# EAGLE board jb-main (EAGLE 4.15), part 1 of 2
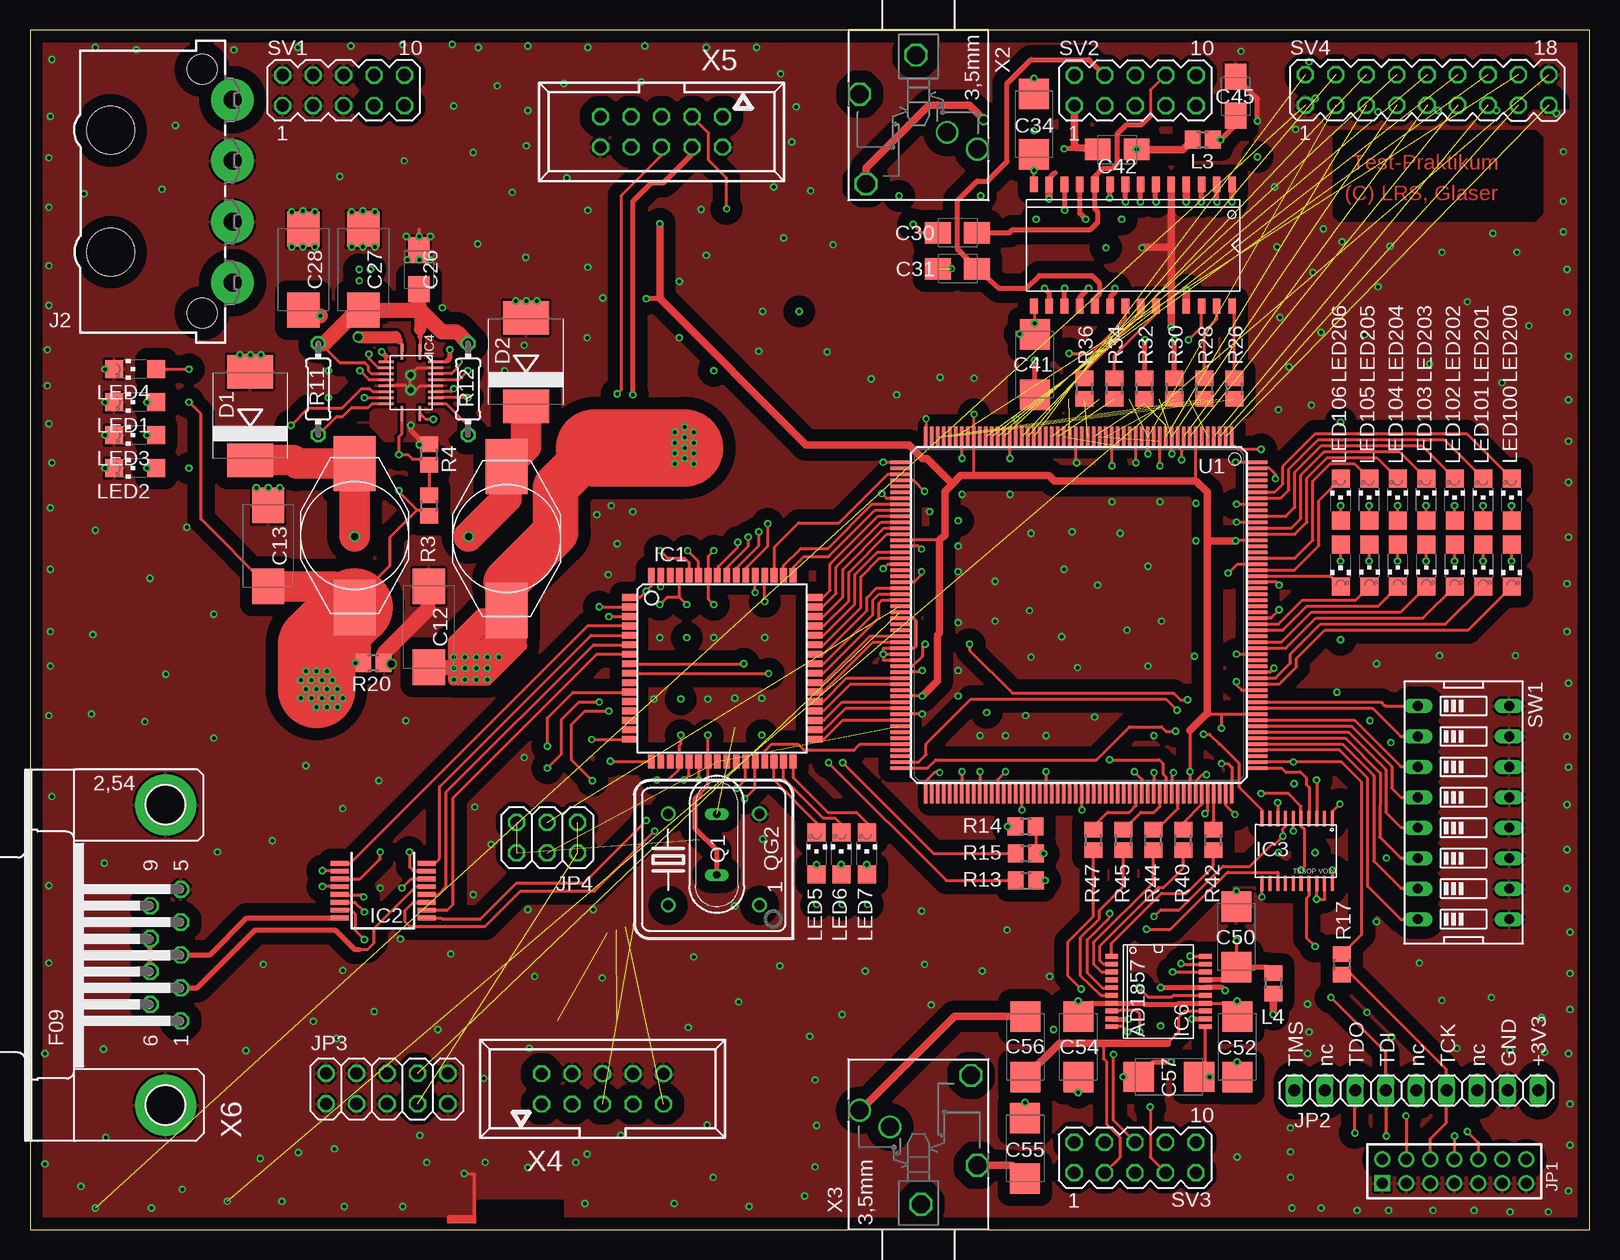
[diagram p7: board, top side]
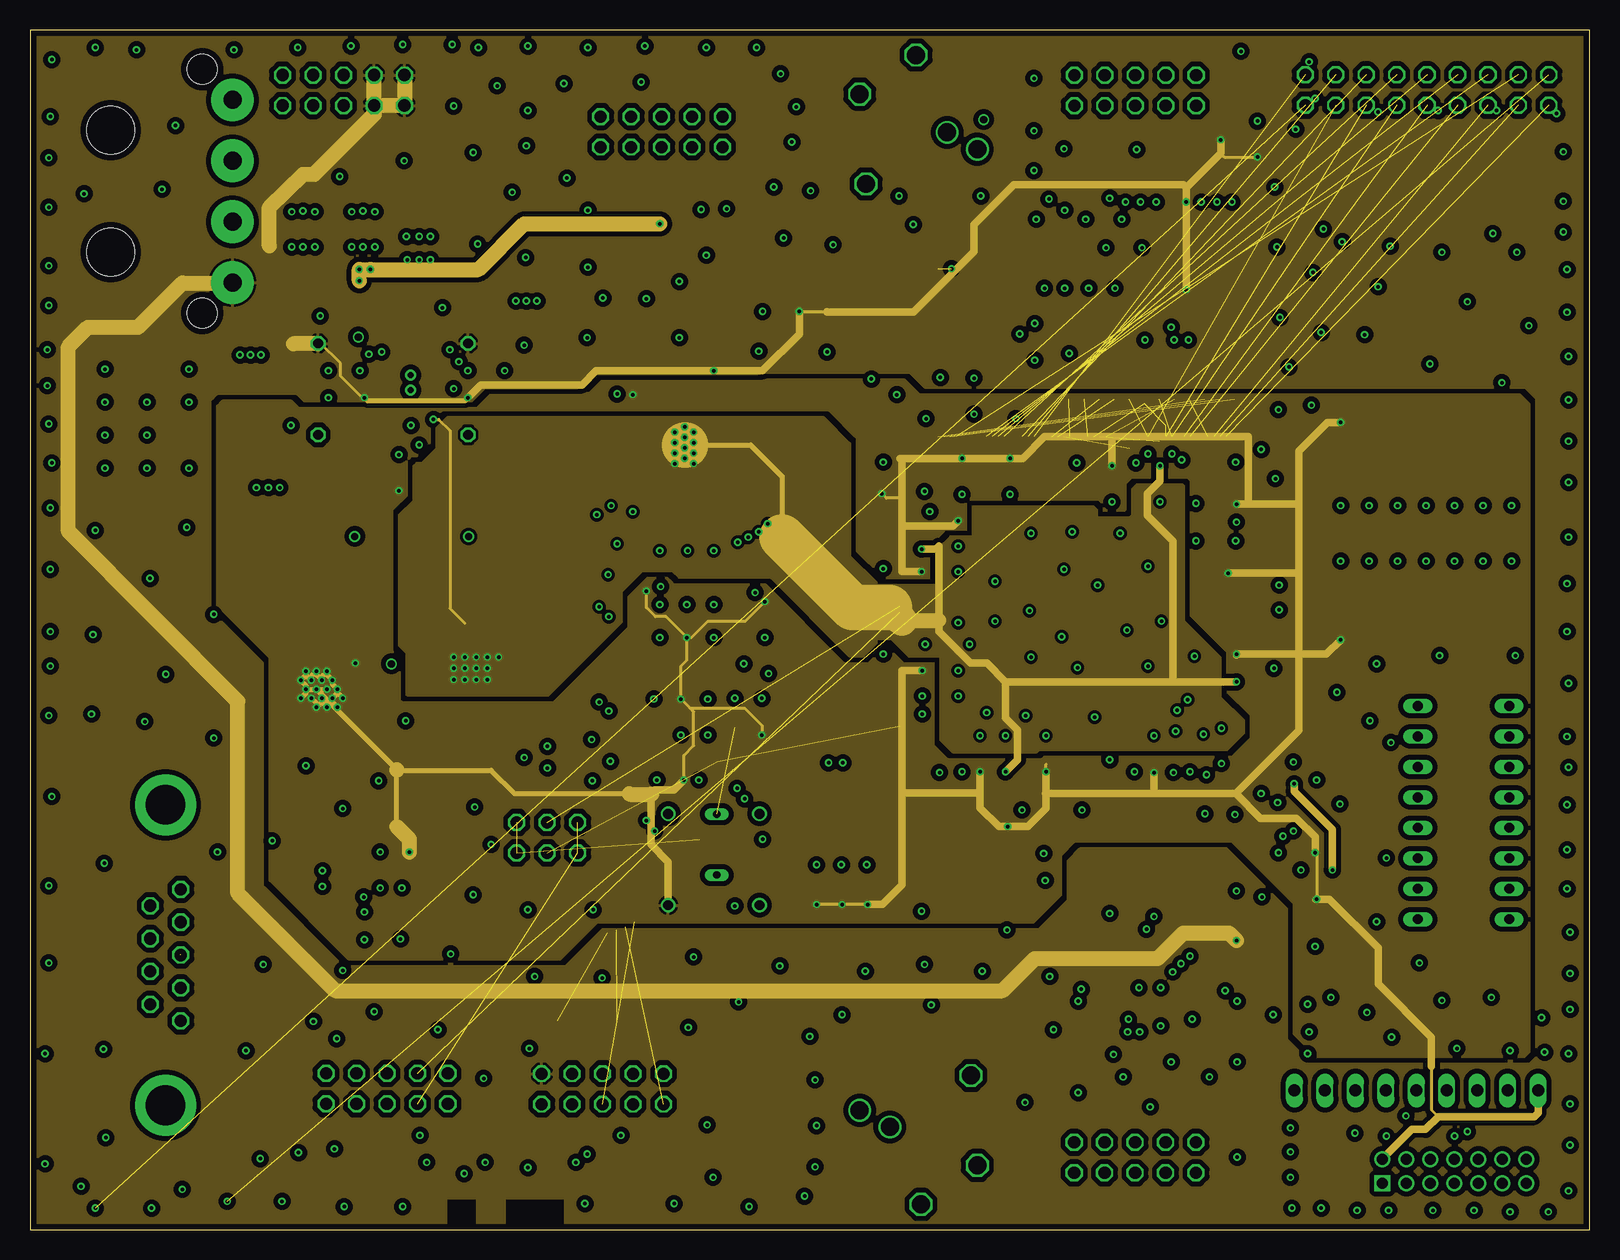
[diagram p8: board, inner layer Route2]
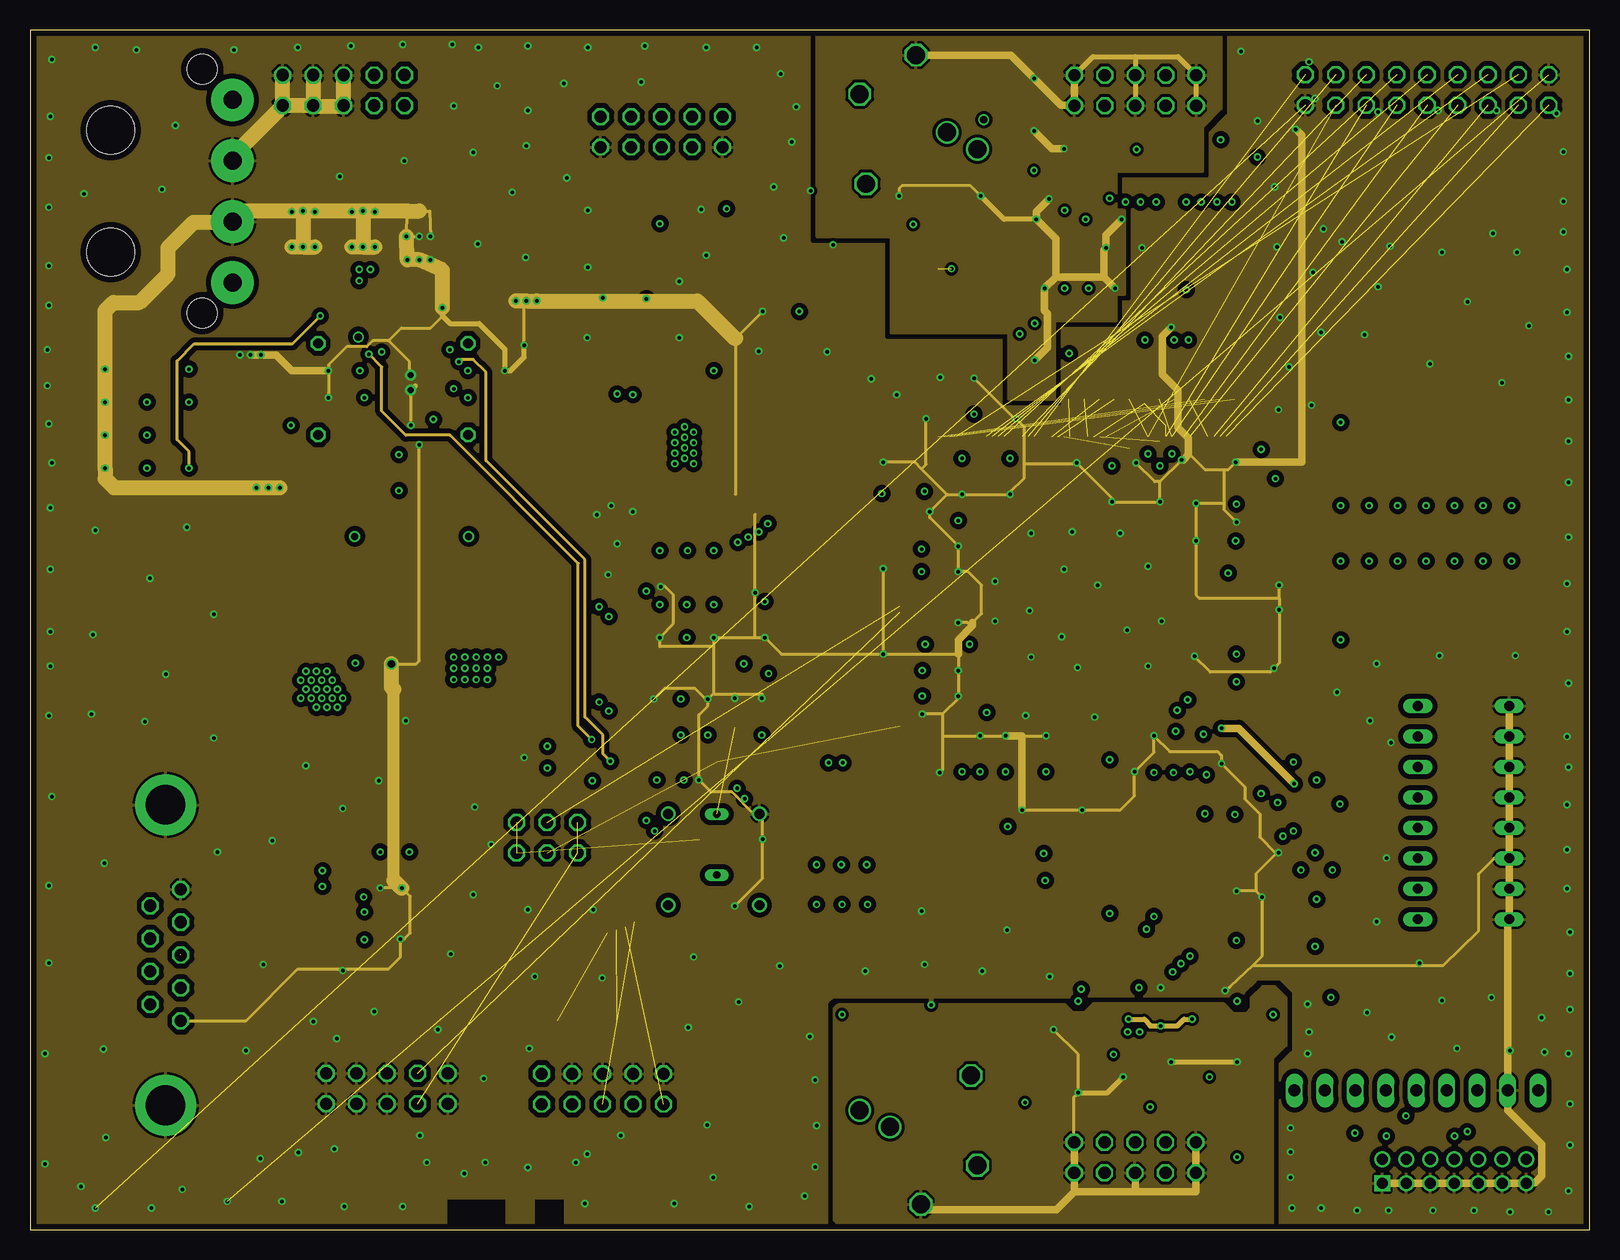
[diagram p9: board, inner layer Route15]
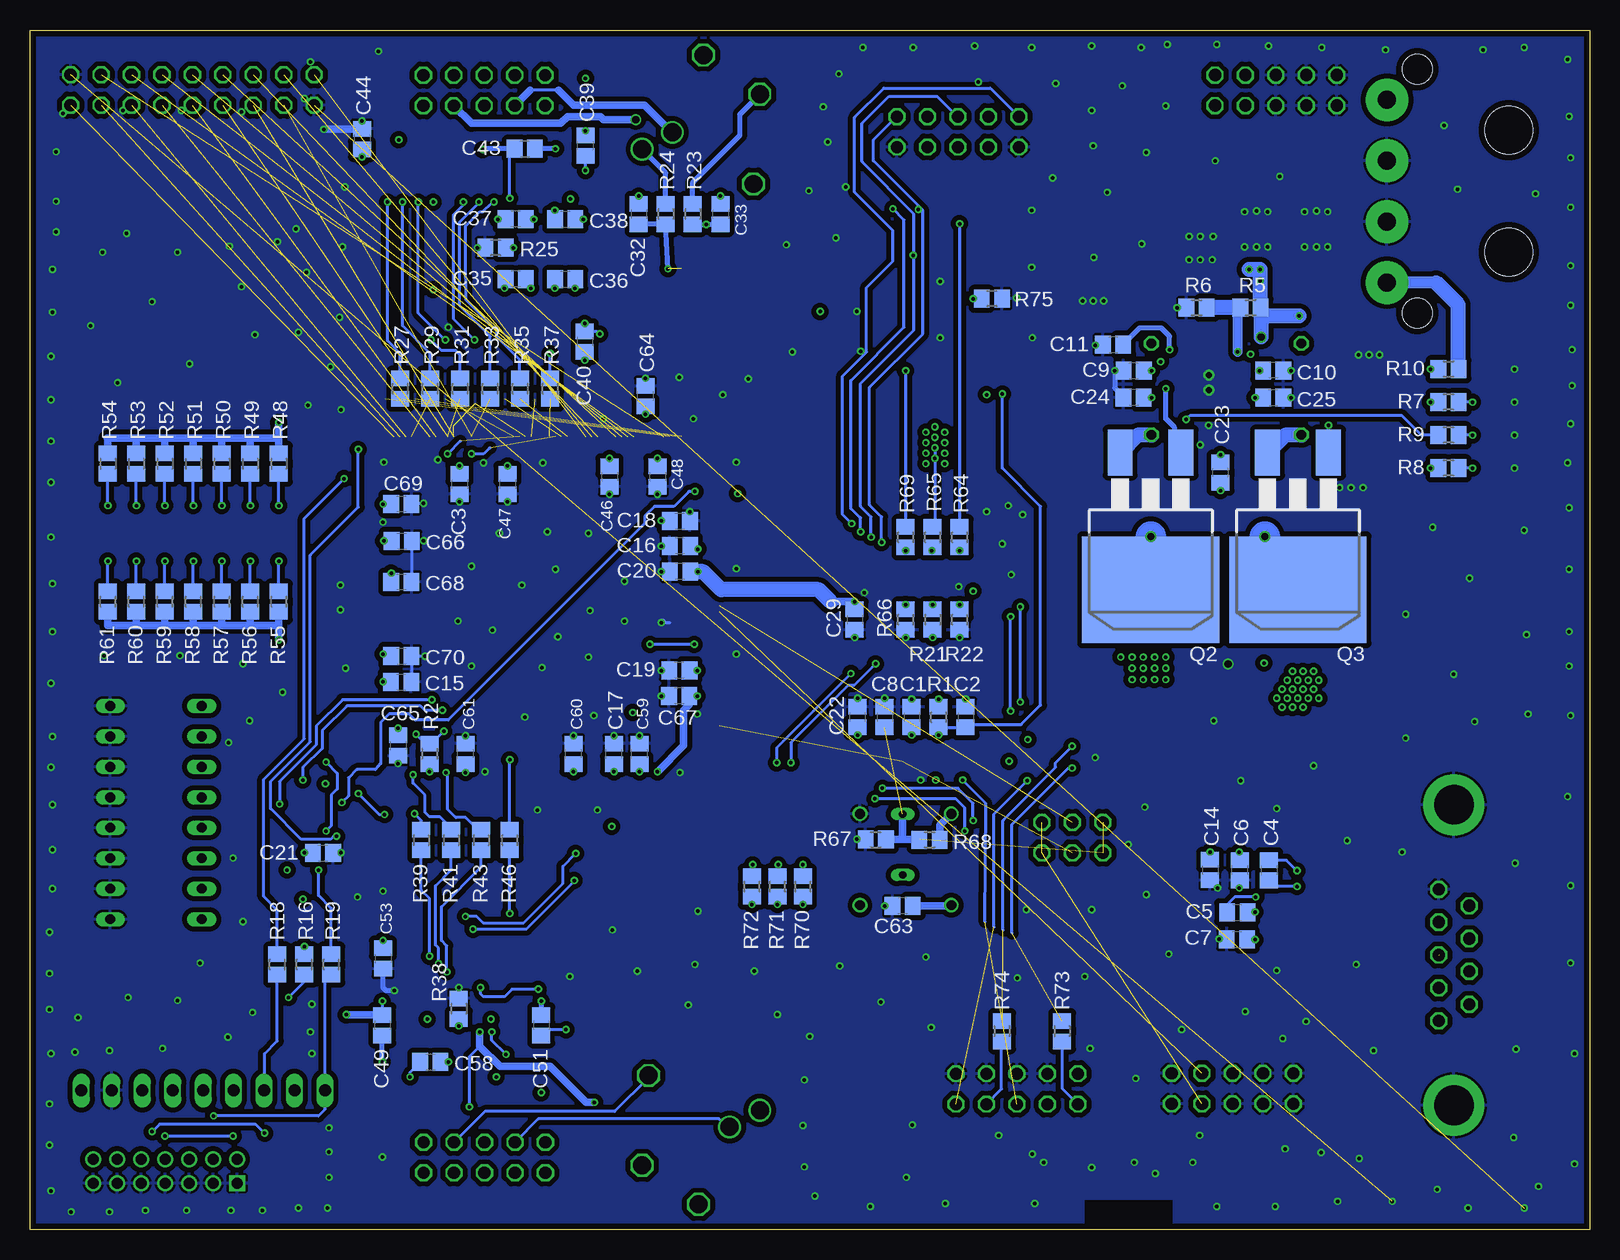
[diagram p10: board, bottom side, seen from below]

Size 130 x 100 mm. Coordinates in mm from the lower left corner, seen from the top.
Outline: 0,0 130,0 130,100 0,100 0,0
Copper layers (1*2*15*16): Top 0.035mm / dielectric 0.38mm / Route2 0.035mm / dielectric 0.71mm / Route15 0.035mm / dielectric 0.38mm / Bottom 0.035mm
Design rules "PCB-POOL-4-layer": minimum track width 0.15mm, minimum drill 0.3mm, track to track 0.15mm, track to pad 0.15mm, pad to pad 0.15mm, via to via 0.15mm, smd to smd 0mil, copper to edge 20mil, drill to drill 8mil, minimum pad ring 8mil, minimum via ring 6mil, stop-mask expansion 3mil, vias tented up to drill 0mil, thermal gap 8mil

## Footprints (pad centres in the part's own frame; a part is rotated, then mirrored left to right if it is on the bottom)
C0805 = smd 1.3 x 1.5: 1 -0.85,0; 2 0.85,0
D/7343-31W = smd 2.95 x 2.7: + 3.375,0; - -3.375,0
B/3528-21W = smd 2.15 x 1.8: + 1.625,0; - -1.625,0
C/6032-28R = smd 2.55 x 2.5: + 2.525,0; - -2.525,0
SMC = smd 2.8 x 3.8: A 3.7,0; C -3.7,0
TQFP64 = smd 1.194 x 0.559: 1 -7.76,5.905; 2 -7.76,5.118; 3 -7.76,4.331; 4 -7.76,3.543; 5 -7.76,2.756; 6 -7.76,1.968; 7 -7.76,1.181; 8 -7.76,0.394; 9 -7.76,-0.394; 10 -7.76,-1.181; 11 -7.76,-1.968; 12 -7.76,-2.756; 13 -7.76,-3.543; 14 -7.76,-4.331; 15 -7.76,-5.118; 16 -7.76,-5.905; 33 7.76,-5.905; 34 7.76,-5.118; 35 7.76,-4.331; 36 7.76,-3.543; 37 7.76,-2.756; 38 7.76,-1.968; 39 7.76,-1.181; 40 7.76,-0.394; 41 7.76,0.394; 42 7.76,1.181; 43 7.76,1.968; 44 7.76,2.756; 45 7.76,3.543; 46 7.76,4.331; 47 7.76,5.118; 48 7.76,5.905 | smd 0.559 x 1.194: 17 -5.905,-7.76; 18 -5.118,-7.76; 19 -4.331,-7.76; 20 -3.543,-7.76; 21 -2.756,-7.76; 22 -1.968,-7.76; 23 -1.181,-7.76; 24 -0.394,-7.76; 25 0.394,-7.76; 26 1.181,-7.76; 27 1.968,-7.76; 28 2.756,-7.76; 29 3.543,-7.76; 30 4.331,-7.76; 31 5.118,-7.76; 32 5.905,-7.76; 49 5.905,7.76; 50 5.118,7.76; 51 4.331,7.76; 52 3.543,7.76; 53 2.756,7.76; 54 1.968,7.76; 55 1.181,7.76; 56 0.394,7.76; 57 -0.394,7.76; 58 -1.181,7.76; 59 -1.968,7.76; 60 -2.756,7.76; 61 -3.543,7.76; 62 -4.331,7.76; 63 -5.118,7.76; 64 -5.905,7.76
SSOP16 = smd 0.4 x 1.5: 1 -2.275,-3.625; 2 -1.625,-3.625; 3 -0.975,-3.625; 4 -0.325,-3.625; 5 0.325,-3.625; 6 0.975,-3.625; 7 1.625,-3.625; 8 2.275,-3.625; 9 2.275,3.625; 10 1.625,3.625; 11 0.975,3.625; 12 0.325,3.625; 13 -0.325,3.625; 14 -0.975,3.625; 15 -1.625,3.625; 16 -2.275,3.625
VO20 = smd 0.254 x 1.27: 1 2.928,2.701; 2 2.276,2.7; 3 1.626,2.7; 4 0.977,2.701; 5 0.325,2.7; 6 -0.325,2.7; 7 -0.975,2.7; 8 -1.626,2.7; 9 -2.276,2.7; 10 -2.926,2.7; 11 -2.928,-2.7; 12 -2.28,-2.7; 13 -1.623,-2.7; 14 -0.975,-2.7; 15 -0.328,-2.7; 16 0.328,-2.7; 17 0.975,-2.71; 18 1.623,-2.7; 19 2.28,-2.7; 20 2.928,-2.7
R-PQFP-20 = smd 1.27 x 0.203: 1 -7.317,1.5; 10 -2.183,1.5; 11 -2.183,3; 20 -7.317,3 | smd 0.203 x 1.27: 2 -6.5,0.182; 3 -6,0.182; 4 -5.5,0.182; 5 -5,0.182; 6 -4.5,0.182; 7 -4,0.182; 8 -3.5,0.182; 9 -3,0.182; 12 -3,4.317; 13 -3.5,4.317; 14 -4,4.317; 15 -4.5,4.317; 16 -5,4.317; 17 -5.5,4.317; 18 -6,4.317; 19 -6.5,4.317 | drill 0.5 round: TGND1 -5.385,2.226; TGND2 -4.135,2.226
R-28 = smd 1.27 x 0.635: 1 -5.08,8.255; 2 -5.08,6.985; 3 -5.08,5.715; 4 -5.08,4.445; 5 -5.08,3.175; 6 -5.08,1.905; 7 -5.08,0.635; 8 -5.08,-0.635; 9 -5.08,-1.905; 10 -5.08,-3.175; 11 -5.08,-4.445; 12 -5.08,-5.715; 13 -5.08,-6.985; 14 -5.08,-8.255; 15 5.08,-8.255; 16 5.08,-6.985; 17 5.08,-5.715; 18 5.08,-4.445; 19 5.08,-3.175; 20 5.08,-1.905; 21 5.08,-0.635; 22 5.08,0.635; 23 5.08,1.905; 24 5.08,3.175; 25 5.08,4.445; 26 5.08,5.715; 27 5.08,6.985; 28 5.08,8.255
RS-20 = smd 1.067 x 0.406: 1 -3.901,2.926; 2 -3.901,2.276; 3 -3.901,1.626; 4 -3.901,0.975; 5 -3.901,0.325; 6 -3.901,-0.325; 7 -3.901,-0.975; 8 -3.901,-1.626; 9 -3.901,-2.276; 10 -3.901,-2.926; 11 3.901,-2.926; 12 3.901,-2.276; 13 3.901,-1.626; 14 3.901,-0.975; 15 3.901,-0.325; 16 3.901,0.325; 17 3.901,0.975; 18 3.901,1.626; 19 3.901,2.276; 20 3.901,2.926
827001 = drill 1.5 pad 3.556 round: 1 -7.62,0; 2 -2.54,0; 3 2.54,0; 4 7.62,0 | hole 4: 5.08,-10.16; -5.08,-10.16 | hole 2.5: 10.16,-2.54; -10.16,-2.54
2X07M = drill 0.914 square: 1 -6,-1 | drill 0.914 round: 2 -6,1; 3 -4,-1; 4 -4,1; 5 -2,-1; 6 -2,1; 7 0,-1; 8 0,1; 9 2,-1; 10 2,1; 11 4,-1; 12 4,1; 13 6,-1; 14 6,1
1X09 = drill 1.016 long: 1 -10.16,0; 2 -7.62,0; 3 -5.08,0; 4 -2.54,0; 5 0,0; 6 2.54,0; 7 5.08,0; 8 7.62,0; 9 10.16,0
2X05 = drill 1.016 octagon: 1 -5.08,-1.27; 2 -5.08,1.27; 3 -2.54,-1.27; 4 -2.54,1.27; 5 0,-1.27; 6 0,1.27; 7 2.54,-1.27; 8 2.54,1.27; 9 5.08,-1.27; 10 5.08,1.27
2X03 = drill 1.016 octagon: 1 -2.54,-1.27; 2 -2.54,1.27; 3 0,-1.27; 4 0,1.27; 5 2.54,-1.27; 6 2.54,1.27
L-13X10 = smd 3.5 x 4.6: 1 0,6; 2 0,-6
R0805 = smd 1.3 x 1.5: 1 -0.85,0; 2 0.85,0
CHIPLED_1206 = smd 1.5 x 1.5: A 0,-1.75; C 0,1.75
QS = drill 0.61 long: 1 -2.54,0; 2 2.54,0
D2PACK = smd 2.083 x 3.81: 1 -2.54,-8.89; 3 2.54,-8.89 | smd 11.43 x 8.89: 2 0,2.54
DIL08S = drill 0.813 round: 1 -3.81,-3.81; 4 3.81,-3.81; 5 3.81,3.81; 8 -3.81,3.81
0204/7 = drill 0.813 octagon: 1 -3.81,0; 2 3.81,0
MA05-2 = drill 1.016 octagon: 1 -5.08,-1.27; 2 -5.08,1.27; 3 -2.54,-1.27; 4 -2.54,1.27; 5 0,-1.27; 6 0,1.27; 7 2.54,-1.27; 8 2.54,1.27; 9 5.08,-1.27; 10 5.08,1.27
MA09-2 = drill 1.016 octagon: 1 -10.16,-1.27; 2 -10.16,1.27; 3 -7.62,-1.27; 4 -7.62,1.27; 5 -5.08,-1.27; 6 -5.08,1.27; 7 -2.54,-1.27; 8 -2.54,1.27; 9 0,-1.27; 10 0,1.27; 11 2.54,-1.27; 12 2.54,1.27; 13 5.08,-1.27; 14 5.08,1.27; 15 7.62,-1.27; 16 7.62,1.27; 17 10.16,-1.27; 18 10.16,1.27
EDG-08 = drill 0.813 long: 1 -8.89,-3.81; 2 -6.35,-3.81; 3 -3.81,-3.81; 4 -1.27,-3.81; 5 1.27,-3.81; 6 3.81,-3.81; 7 6.35,-3.81; 8 8.89,-3.81; 9 8.89,3.81; 10 6.35,3.81; 11 3.81,3.81; 12 1.27,3.81; 13 -1.27,3.81; 14 -3.81,3.81; 15 -6.35,3.81; 16 -8.89,3.81
PQ208 = smd 1.6 x 0.3: P1 -14.9,12.75; P2 -14.9,12.25; P3 -14.9,11.75; P4 -14.9,11.25; P5 -14.9,10.75; P6 -14.9,10.25; P7 -14.9,9.75; P8 -14.9,9.25; P9 -14.9,8.75; P10 -14.9,8.25; P11 -14.9,7.75; P12 -14.9,7.25; P13 -14.9,6.75; P14 -14.9,6.25; P15 -14.9,5.75; P16 -14.9,5.25; P17 -14.9,4.75; P18 -14.9,4.25; P19 -14.9,3.75; P20 -14.9,3.25; P21 -14.9,2.75; P22 -14.9,2.25; P23 -14.9,1.75; P24 -14.9,1.25; P25 -14.9,0.75; P26 -14.9,0.25; P27 -14.9,-0.25; P28 -14.9,-0.75; P29 -14.9,-1.25; P30 -14.9,-1.75; P31 -14.9,-2.25; P32 -14.9,-2.75; P33 -14.9,-3.25; P34 -14.9,-3.75; P35 -14.9,-4.25; P36 -14.9,-4.75; P37 -14.9,-5.25; P38 -14.9,-5.75; P39 -14.9,-6.25; P40 -14.9,-6.75; P41 -14.9,-7.25; P42 -14.9,-7.75; P43 -14.9,-8.25; P44 -14.9,-8.75; P45 -14.9,-9.25; P46 -14.9,-9.75; P47 -14.9,-10.25; P48 -14.9,-10.75; P49 -14.9,-11.25; P50 -14.9,-11.75; P51 -14.9,-12.25; P52 -14.9,-12.75; P105 14.9,-12.75; P106 14.9,-12.25; P107 14.9,-11.75; P108 14.9,-11.25; P109 14.9,-10.75; P110 14.9,-10.25; P111 14.9,-9.75; P112 14.9,-9.25; P113 14.9,-8.75; P114 14.9,-8.25; P115 14.9,-7.75; P116 14.9,-7.25; P117 14.9,-6.75; P118 14.9,-6.25; P119 14.9,-5.75; P120 14.9,-5.25; P121 14.9,-4.75; P122 14.9,-4.25; P123 14.9,-3.75; P124 14.9,-3.25; P125 14.9,-2.75; P126 14.9,-2.25; P127 14.9,-1.75; P128 14.9,-1.25; P129 14.9,-0.75; P130 14.9,-0.25; P131 14.9,0.25; P132 14.9,0.75; P133 14.9,1.25; P134 14.9,1.75; P135 14.9,2.25; P136 14.9,2.75; P137 14.9,3.25; P138 14.9,3.75; P139 14.9,4.25; P140 14.9,4.75; P141 14.9,5.25; P142 14.9,5.75; P143 14.9,6.25; P144 14.9,6.75; P145 14.9,7.25; P146 14.9,7.75; P147 14.9,8.25; P148 14.9,8.75; P149 14.9,9.25; P150 14.9,9.75; P151 14.9,10.25; P152 14.9,10.75; P153 14.9,11.25; P154 14.9,11.75; P155 14.9,12.25; P156 14.9,12.75 | smd 0.3 x 1.6: P53 -12.75,-14.9; P54 -12.25,-14.9; P55 -11.75,-14.9; P56 -11.25,-14.9; P57 -10.75,-14.9; P58 -10.25,-14.9; P59 -9.75,-14.9; P60 -9.25,-14.9; P61 -8.75,-14.9; P62 -8.25,-14.9; P63 -7.75,-14.9; P64 -7.25,-14.9; P65 -6.75,-14.9; P66 -6.25,-14.9; P67 -5.75,-14.9; P68 -5.25,-14.9; P69 -4.75,-14.9; P70 -4.25,-14.9; P71 -3.75,-14.9; P72 -3.25,-14.9; P73 -2.75,-14.9; P74 -2.25,-14.9; P75 -1.75,-14.9; P76 -1.25,-14.9; P77 -0.75,-14.9; P78 -0.25,-14.9; P79 0.25,-14.9; P80 0.75,-14.9; P81 1.25,-14.9; P82 1.75,-14.9; P83 2.25,-14.9; P84 2.75,-14.9; P85 3.25,-14.9; P86 3.75,-14.9; P87 4.25,-14.9; P88 4.75,-14.9; P89 5.25,-14.9; P90 5.75,-14.9; P91 6.25,-14.9; P92 6.75,-14.9; P93 7.25,-14.9; P94 7.75,-14.9; P95 8.25,-14.9; P96 8.75,-14.9; P97 9.25,-14.9; P98 9.75,-14.9; P99 10.25,-14.9; P100 10.75,-14.9; P101 11.25,-14.9; P102 11.75,-14.9; P103 12.25,-14.9; P104 12.75,-14.9; P157 12.75,14.9; P158 12.25,14.9; P159 11.75,14.9; P160 11.25,14.9; P161 10.75,14.9; P162 10.25,14.9; P163 9.75,14.9; P164 9.25,14.9; P165 8.75,14.9; P166 8.25,14.9; P167 7.75,14.9; P168 7.25,14.9; P169 6.75,14.9; P170 6.25,14.9; P171 5.75,14.9; P172 5.25,14.9; P173 4.75,14.9; P174 4.25,14.9; P175 3.75,14.9; P176 3.25,14.9; P177 2.75,14.9; P178 2.25,14.9; P179 1.75,14.9; P180 1.25,14.9; P181 0.75,14.9; P182 0.25,14.9; P183 -0.25,14.9; P184 -0.75,14.9; P185 -1.25,14.9; P186 -1.75,14.9; P187 -2.25,14.9; P188 -2.75,14.9; P189 -3.25,14.9; P190 -3.75,14.9; P191 -4.25,14.9; P192 -4.75,14.9; P193 -5.25,14.9; P194 -5.75,14.9; P195 -6.25,14.9; P196 -6.75,14.9; P197 -7.25,14.9; P198 -7.75,14.9; P199 -8.25,14.9; P200 -8.75,14.9; P201 -9.25,14.9; P202 -9.75,14.9; P203 -10.25,14.9; P204 -10.75,14.9; P205 -11.25,14.9; P206 -11.75,14.9; P207 -12.25,14.9; P208 -12.75,14.9
PG203J = drill 1.499 octagon: 1 -5.004,-0.203; 4 5.74,-4.369; 5 -1.753,-4.902 | drill 1.499 round: 2 2.845,4.902; 3 1.448,2.388
057-010-1 = drill 1 octagon: 1 -5.08,-1.27; 2 -5.08,1.27; 3 -2.54,-1.27; 4 -2.54,1.27; 5 0,-1.27; 6 0,1.27; 7 2.54,-1.27; 8 2.54,1.27; 9 5.08,-1.27; 10 5.08,1.27
F09HP = drill 1.016 octagon: 1 -5.486,-1.27; 2 -2.743,-1.27; 3 0,-1.27; 4 2.743,-1.27; 5 5.486,-1.27; 6 -4.115,1.27; 7 -1.372,1.27; 8 1.372,1.27; 9 4.115,1.27 | drill 3.302 pad 5.08 round: G1 -12.522,0; G2 12.522,0

## Placement (x,y rotation side)
C1  15p  [C0805]  56.5,42.72 270 bottom
C2  100n  [C0805]  52,42.72 270 bottom
C3  100n  [C0805]  94.19,62.16 270 bottom
C4  100n  [C0805]  26.72,29.95 270 bottom
C5  100n  [C0805]  29.36,26.44 0 bottom
C6  100n  [C0805]  29.16,29.95 90 bottom
C7  100n  [C0805]  29.4,24.18 0 bottom
C8  15p  [C0805]  58.75,42.72 270 bottom
C9  1n5  [C0805]  38,71.6 0 bottom
C10  1n5  [C0805]  26.37,71.62 180 bottom
C11  10n  [C0805]  39.71,73.76 0 bottom
C12  100u  [D/7343-31W]  33.25,50.23 270 top
C13  100u  [D/7343-31W]  19.86,56.98 270 top
C14  100n  [C0805]  31.63,29.97 270 bottom
C15  100n  [C0805]  99.07,45.66 0 bottom
C16  100n  [C0805]  75.82,56.97 180 bottom
C17  100n  [C0805]  81.32,39.66 90 bottom
C18  100n  [C0805]  75.83,59.07 0 bottom
C19  100n  [C0805]  75.87,46.62 180 bottom
C20  100n  [C0805]  75.81,54.86 180 bottom
C21  100n  [C0805]  105.58,31.4 0 bottom
C22  100n  [C0805]  61,42.72 90 bottom
C23  10p  [C0805]  30.75,63.09 90 bottom
C24  100n  [C0805]  38,69.34 180 bottom
C25  100n  [C0805]  26.37,69.37 0 bottom
C26  1u  [B/3528-21W]  32.42,80.03 270 top
C27  100u  [D/7343-31W]  27.79,80.03 270 top
C28  10u  [D/7343-31W]  22.8,80.03 270 top
C29  100n  [C0805]  61.25,50.84 270 bottom
C30  1u  [B/3528-21W]  77.32,83.09 0 top
C31  1u  [B/3528-21W]  77.32,80.09 0 top
C32  2n2  [C0805]  79.25,84.66 270 bottom
C33  2n2  [C0805]  72.44,84.66 270 bottom
C34  4u7  [C/6032-28R]  83.69,92.16 270 top
C35  470p  [C0805]  89.5,79.22 180 bottom
C36  470p  [C0805]  85.38,79.22 0 bottom
C37  470p  [C0805]  89.5,84.22 180 bottom
C38  470p  [C0805]  85.38,84.22 0 bottom
C39  100n  [C0805]  83.69,90.34 90 bottom
C40  100n  [C0805]  83.75,74.03 270 bottom
C41  4u7  [C/6032-28R]  83.75,72.09 90 top
C42  1u  [B/3528-21W]  90.63,90.03 0 top
C43  100n  [C0805]  88.75,90.09 0 bottom
C44  10n  [C0805]  102.32,90.91 270 bottom
C45  1u  [B/3528-21W]  100.5,94.47 270 top
C46  100n  [C0805]  81.69,62.78 270 bottom
C47  100n  [C0805]  90.19,62.16 270 bottom
C48  100n  [C0805]  77.69,62.78 270 bottom
C49  100n  [C0805]  100.63,17.03 270 bottom
C50  4u7  [C/6032-28R]  100.57,24.41 270 top
C51  100n  [C0805]  87.38,17.03 270 bottom
C52  4u7  [C/6032-28R]  100.63,15.22 90 top
C53  10n  [C0805]  100.57,22.59 270 bottom
C54  4u7  [C/6032-28R]  87.38,15.22 90 top
C55  4u7  [C/6032-28R]  82.95,6.76 90 top
C56  4u7  [C/6032-28R]  82.98,15.24 270 top
C57  4u7  [C/6032-28R]  94.94,12.72 0 top
C58  100n  [C0805]  96.63,13.97 0 bottom
C59  100n  [C0805]  79.19,39.66 90 bottom
C60  100n  [C0805]  84.69,39.66 90 bottom
C61  100n  [C0805]  93.69,39.66 90 bottom
C63  100n  [C0805]  57.25,26.97 180 bottom
C64  100n  [C0805]  78.69,69.47 90 bottom
C65  100n  [C0805]  99.32,40.34 270 bottom
C66  100n  [C0805]  99,57.41 0 bottom
C67  100n  [C0805]  75.88,44.47 180 bottom
C68  100n  [C0805]  99.04,53.99 0 bottom
C69  100n  [C0805]  99.04,60.5 0 bottom
C70  100n  [C0805]  99.04,47.82 0 bottom
D1  MBRS340T3  [SMC]  18.36,67.81 90 top
D2  MBRS340T3  [SMC]  41.35,72.31 90 top
IC1  MEGA64-A  [TQFP64]  57.69,46.77 0 top
IC2  MAX3221CAE  [SSOP16]  29.42,28.25 270 top
IC3  XCF04S-VO20  [VO20]  105.63,31.54 0 top
IC4  TPS75003  [R-PQFP-20]  29.5,65.84 270 top
IC5  AD1870SOL-28  [R-28]  91.94,82.05 270 top
IC6  AD1857  [RS-20]  94.07,19.84 0 top
J2  [827001]  16.89,86.56 270 top
JP1  [2X07M]  118.73,4.86 0 top
JP2  JTAG FPGA  [1X09]  115.56,11.6 0 top
JP3  [2X05]  29.75,11.75 0 top
JP4  [2X03]  43.11,32.66 180 top
L1  15u  [L-13X10]  39.71,57.59 0 top
L2  L-13X10  [L-13X10]  27.05,57.84 0 top
L3  1u  [R0805]  97.75,90.84 0 top
L4  1u  [R0805]  103.63,20.53 270 top
LED1  +3V3  [CHIPLED_1206]  8.75,68.97 90 top
LED2  +2V5  [CHIPLED_1206]  8.75,63.47 90 top
LED3  +1V8  [CHIPLED_1206]  8.75,66.22 90 top
LED4  +5V0  [CHIPLED_1206]  8.75,71.72 90 top
LED5  GRÜN  [CHIPLED_1206]  65.57,31.34 0 top
LED6  GELB  [CHIPLED_1206]  67.63,31.34 0 top
LED7  ROT  [CHIPLED_1206]  69.75,31.34 0 top
LED100  ROT  [CHIPLED_1206]  123.5,55.34 180 top
LED101  GELB  [CHIPLED_1206]  121.13,55.37 180 top
LED102  GELB  [CHIPLED_1206]  118.76,55.37 180 top
LED103  GRÜN  [CHIPLED_1206]  116.39,55.37 180 top
LED104  GRÜN  [CHIPLED_1206]  114.03,55.37 180 top
LED105  GRÜN  [CHIPLED_1206]  111.66,55.37 180 top
LED106  GRÜN  [CHIPLED_1206]  109.25,55.34 180 top
LED200  ROT  [CHIPLED_1206]  123.5,60.84 0 top
LED201  GELB  [CHIPLED_1206]  121.13,60.84 0 top
LED202  GELB  [CHIPLED_1206]  118.75,60.84 0 top
LED203  GRÜN  [CHIPLED_1206]  116.38,60.84 0 top
LED204  GRÜN  [CHIPLED_1206]  114,60.84 0 top
LED205  GRÜN  [CHIPLED_1206]  111.63,60.84 0 top
LED206  GRÜN  [CHIPLED_1206]  109.25,60.84 0 top
Q1  <=8MHz  [QS]  57.25,32.09 270 top
Q2  IRFR5305  [D2PACK]  36.58,55.88 180 bottom
Q3  IRFR5305  [D2PACK]  24.3,55.88 180 bottom
QG2  <=8MHz  [DIL08S]  57,30.84 90 top
R1  10k  [R0805]  54.25,42.72 90 bottom
R2  330  [R0805]  96.69,39.66 270 bottom
R3  56k  [R0805]  33.25,60.34 270 top
R4  33k  [R0805]  33.25,64.59 270 top
R5  39k  [R0805]  28.25,76.84 0 bottom
R6  10k  [R0805]  32.75,76.84 0 bottom
R7  150  [R0805]  11.75,68.97 180 bottom
R8  100  [R0805]  11.75,63.47 180 bottom
R9  10  [R0805]  11.75,66.22 180 bottom
R10  220  [R0805]  11.75,71.72 0 bottom
R11  33m  [0204/7]  24.03,70.06 90 top
R12  33m  [0204/7]  36.52,70.06 90 top
R13  100  [R0805]  83.02,29.09 0 top
R14  100  [R0805]  83.02,31.34 0 top
R15  4k7  [R0805]  82.99,33.59 180 top
R16  30  [R0805]  107.13,22.09 90 bottom
R17  30  [R0805]  109.37,22.11 90 top
R18  30  [R0805]  109.38,22.09 90 bottom
R19  30  [R0805]  104.88,22.09 90 bottom
R20  47  [R0805]  28.63,47.22 180 top
R21  1k  [R0805]  54.75,50.84 270 bottom
R22  3k3  [R0805]  52.5,50.84 90 bottom
R23  330  [R0805]  74.75,84.66 270 bottom
R24  330  [R0805]  77,84.66 270 bottom
R25  0  [R0805]  91.19,81.84 180 bottom
R26  4k7  [R0805]  100.38,70.09 270 top
R27  4k7  [R0805]  99.13,70.09 90 bottom
R28  4k7  [R0805]  97.88,70.09 270 top
R29  4k7  [R0805]  96.63,70.09 90 bottom
R30  4k7  [R0805]  95.38,70.09 270 top
R31  4k7  [R0805]  94.13,70.09 90 bottom
R32  4k7  [R0805]  92.88,70.09 270 top
R33  4k7  [R0805]  91.63,70.09 90 bottom
R34  4k7  [R0805]  90.38,70.09 270 top
R35  4k7  [R0805]  89.13,70.09 90 bottom
R36  4k7  [R0805]  87.88,70.09 270 top
R37  4k7  [R0805]  86.63,70.09 90 bottom
R38  0  [R0805]  94.25,18.41 270 bottom
R39  4k7  [R0805]  97.38,32.47 270 bottom
R40  4k7  [R0805]  96.13,32.47 90 top
R41  4k7  [R0805]  94.88,32.47 270 bottom
R42  4k7  [R0805]  98.63,32.47 90 top
R43  4k7  [R0805]  92.38,32.47 270 bottom
R44  4k7  [R0805]  93.63,32.47 90 top
R45  4k7  [R0805]  91.13,32.47 270 top
R46  4k7  [R0805]  90,32.47 90 bottom
R47  4k7  [R0805]  88.63,32.47 270 top
R48  100  [R0805]  109.25,63.84 270 bottom
R49  100  [R0805]  111.63,63.84 270 bottom
R50  100  [R0805]  114,63.84 270 bottom
R51  100  [R0805]  116.38,63.84 270 bottom
R52  100  [R0805]  118.75,63.84 270 bottom
R53  100  [R0805]  121.13,63.84 270 bottom
R54  150  [R0805]  123.5,63.84 270 bottom
R55  100  [R0805]  109.25,52.34 90 bottom
R56  100  [R0805]  111.63,52.34 90 bottom
R57  100  [R0805]  114,52.34 90 bottom
R58  100  [R0805]  116.38,52.34 90 bottom
R59  100  [R0805]  118.75,52.34 90 bottom
R60  100  [R0805]  121.13,52.34 90 bottom
R61  150  [R0805]  123.5,52.34 90 bottom
R64  4k7  [R0805]  52.5,57.72 90 bottom
R65  4k7  [R0805]  54.75,57.72 90 bottom
R66  4k7  [R0805]  57,50.84 90 bottom
R67  1k  [R0805]  59.5,32.51 0 bottom
R68  560  [R0805]  55.01,32.5 0 bottom
R69  4k7  [R0805]  57,57.72 90 bottom
R70  100  [R0805]  65.57,28.59 90 bottom
R71  100  [R0805]  67.69,28.59 90 bottom
R72  150  [R0805]  69.82,28.59 90 bottom
R73  1k  [R0805]  43.97,16.53 270 bottom
R74  1k  [R0805]  48.97,16.53 270 bottom
R75  22  [R0805]  49.82,77.59 180 bottom
SV1  [MA05-2]  26.14,94.97 0 top
SV2  [MA05-2]  92.13,94.96 0 top
SV3  [MA05-2]  92.12,6 0 top
SV4  [MA09-2]  116.46,95 0 top
SW1  [EDG-08]  119.5,34.76 270 top
U1  XC3S500EPQ208  [PQ208]  87.43,51.22 270 top
X2  PG203J  [PG203J]  74.07,92.91 270 top
X3  PG203J  [PG203J]  74.07,7.09 90 top
X4  SPI uC  [057-010-1]  47.73,11.73 0 top
X5  JTAG uC  [057-010-1]  52.65,91.52 180 top
X6  [F09HP]  11.3,22.88 90 top

## Tracks (layer width: path | path; a pad name or v marks a point on that pad's centre or on a via)
+3V3  (via drill 0.3)
  Top 0.254: R3.2 32.78,59.97 32.25,59.97 | 32.25,59.97 30.75,61.47 v30.75,61.59 | IC1.52 61.24,52.36 v61.25,52.34 | IC1.64 51.79,53.63 v51.38,53.22 50.84,52.68 IC1.1 | R20.2 v27.13,47.22 | IC2.15 31.97,29.88 31.63,30.22 v31.63,31.47 | IC1.21 54.94,37.91 v54.5,37.47 | C13.+ 14.25,59.21 14.25,67.97 v13.25,68.97 | 32.25,59.97 30,57.72 30,55.34 27.57,52.91 27.57,52.34 27.07,51.84 | U1.P88 74.25,46.47 v74.38,46.59 | U1.P73 73.69,53.97 74.32,54.59 v74.32,54.84 | U1.P46 77.69,66.11 v77.69,64.28 | U1.P38 81.69,66.11 v81.69,64.28 | v100.57,60.47 U1.P201 | v99.88,54.72 100.63,55.47 U1.P191 | v100.57,47.97 U1.P176 | IC3.18 v107.25,27.53 107.94,27.53 107.94,28.81 IC3.19 | U1.P114 79.18,38.14 v79.19,38.16 | R15.2 v81.51,33.59 v81.5,33.59 | U1.P125 84.68,38.14 v84.69,38.16 | U1.P143 93.68,36.33 93.69,36.34 v93.69,38.09 | v71,61.34 71.38,60.97 U1.P59 | U1.P21 90.19,66.11 v90.19,63.66
  Top 0.406: X5.4 55.19,89.66 52.82,87.28 51.82,87.28 50.25,85.72 v50.25,69.59
  Top 1.27: R20.2 27.78,51.13 27.07,51.84
  Top 2.54: L2.2 27.07,51.84 27,51.91 25.3,53.61 C13.+
  Top 6.452: 27,51.91 23.88,48.78 v23.88,46.53 v23.88,45.03
  Route2 0.254: v54.75,49.34 55.13,49.34 56.5,50.72 59.63,50.72 v61.25,52.34 | v51.38,53.22 51.38,51.84 52.13,51.09 53,51.09 v54.75,49.34 | QG2.8 | 55,43.47 59.57,43.47 61,42.03 v61,41.22 | 55,43.47 55.32,43.16 55.32,40.34 54.5,39.53 v54.5,37.47 | 55,43.47 v54.25,44.22 54.25,46.97 54.75,47.47 v54.75,49.34 | v107.13,31.41 107.25,31.41 v107.25,27.53 | 117.38,9.41 116.82,9.97 116.82,13.6 | 84.69,38.78 v84.69,38.16 84.63,38.09 84.63,36.34 | 72.69,60.97 71.38,60.97 v71,61.34 | v69.82,27.09 v67.69,27.09 v65.57,27.09
  Route2 0.406: v23.88,45.03 30.6,38.31 30.63,38.28 38.44,38.28 40.38,36.34 49.94,36.34 | 30.57,33.59 30.57,38.28 | 23,46.22 v22.57,45.78 23,45.34 v23,45.03 | 23,46.22 v23,46.53 | 23,46.22 v23.44,45.78 23.44,46.09 v23.88,46.53 23.88,46.22 v24.32,45.78 24.32,46.09 v24.75,46.53 24.75,46.22 v25.19,45.78 25.19,45.47 v25.63,45.03 25.63,44.72 | 25.63,44.72 v26.07,44.28 | 25.63,44.72 v25.19,44.28 | v25.19,44.28 25.19,43.97 v25.63,43.53 | v25.19,44.28 24.75,43.84 v24.75,43.53 24.32,43.97 | 24.32,43.97 v23.88,43.53 23.88,43.84 v23.44,44.28 | 24.32,43.97 v24.32,44.28 | v23,45.03 23,44.72 v22.57,44.28 | v23,45.03 v24.75,45.03
  Route2 0.61: v54.5,37.47 53.69,36.66 52.07,36.66 51.75,36.34 51.75,36.28 51.75,32.09 53.19,30.66 QG2.8 | JP2.9 125.72,9.75 125.38,9.41 117.38,9.41 116.32,8.35 115.19,8.35 112.7,5.86 | 112.7,5.86 112.69,5.84 | 112.7,5.86 JP1.2 | v109.25,49.16 108.07,47.97 105.75,47.97 | v100.57,47.97 100.57,47.91 100.63,47.97 105.75,47.97 | v109.25,67.28 108.13,67.28 105.75,64.91 105.75,60.47 | 101.57,60.47 105.75,60.47 | 101.57,60.47 v100.57,60.47 | 105.75,60.47 105.75,54.72 | 105.75,54.72 105.75,47.97 | 105.75,54.72 v99.88,54.72 | 116.82,13.6 116.82,16.03 112.38,20.47 112.38,23.47 108.32,27.53 v107.25,27.53 107.19,27.53 | 79.19,36.41 79.19,35.16 80.75,33.59 v81.5,33.59 83.19,33.59 84.69,35.09 v84.69,38.16 | 79.19,36.41 v79.19,38.16 | 93.69,36.34 v93.69,38.09 | 93.69,36.34 84.63,36.34 | v74.38,46.59 72.69,46.59 72.69,36.41 | v74.32,54.84 72.69,54.84 72.69,58.66 | 79.19,36.41 72.69,36.41 | 72.69,58.66 72.69,60.97 72.69,64.09 72.5,64.28 v77.69,64.28 v81.69,64.28 82.75,64.28 84.57,66.09 90.19,66.09 | v77.38,59.09 76.94,58.66 72.69,58.66 | 90.19,66.09 v90.19,63.66 | 90.19,66.09 101.57,66.09 101.57,60.47 | 100.5,36.34 93.69,36.34 | 100.5,36.34 105.75,41.59 105.75,47.97 | 100.5,36.34 102.57,34.28 105.57,34.28 107.13,32.72 v107.13,31.41 | 72.69,36.41 72.69,28.72 71.07,27.09 v69.82,27.09
  Route2 1.27: v31.63,31.47 31.63,32.53 30.57,33.59 | 51.82,36.28 51.75,36.28 50,36.28 49.94,36.34 | 30.57,38.28 | 30.57,38.28 30.6,38.31
  Bottom 0.254: v30.75,61.59 C23.1 | v54.75,49.34 R21.2 | v61.25,52.34 C29.1 | C14.1 v31.63,31.47 | v54.25,44.22 R1.2 | v61,41.22 C22.1 | v13.25,68.97 R7.2 | C19.1 75,46.63 75,46.59 v74.38,46.59 | C20.1 74.94,54.84 v74.32,54.84 | C18.1 76.7,59.09 v77.38,59.09 | v77.69,64.28 C48.1 | v81.69,64.28 C46.1 | C69.1 99.92,60.47 v100.57,60.47 | C68.1 99.88,54.01 v99.88,54.72 | C70.1 100.04,47.97 v100.57,47.97 | 112.75,5.84 112.74,5.86 JP1.2 | C21.1 106.44,31.53 v107.13,31.41 | 79.19,38.84 C59.1 v79.19,38.16 | v93.69,38.09 C61.1 | v90.19,63.66 C47.1 | v69.82,27.09 R72.1 | v67.69,27.09 R71.1 | v65.57,27.09 R70.1 | v84.69,38.16 C60.1
  Bottom 0.61: QG2.8 53.26,26.97 C63.1 | R61.1 123.5,50.34 121.13,50.34 | 109.25,50.34 111.63,50.34 | 111.63,50.34 114,50.34 | 114,50.34 116.38,50.34 | 116.38,50.34 118.75,50.34 | 118.75,50.34 121.13,50.34 | 109.25,51.53 R55.1 109.25,50.34 | 111.63,50.34 R56.1 | 114,50.34 R57.1 | 116.38,50.34 R58.1 | 118.75,50.34 R59.1 | 121.13,50.34 R60.1 | v109.25,49.16 109.25,50.34 | R54.1 123.5,65.91 123.57,65.97 121.13,65.97 | 111.63,65.97 109.25,65.97 R48.1 | 111.63,65.97 114,65.97 | 114,65.97 116.38,65.97 | 116.38,65.97 118.75,65.97 | 118.75,65.97 121.13,65.97 | R48.1 109.25,64.66 | 111.63,65.97 111.63,66.03 | 111.63,65.97 R49.1 | 114,65.97 R50.1 | 116.38,65.97 R51.1 | 118.75,65.97 R52.1 | 121.13,65.97 R53.1 | v109.25,67.28 R48.1 | v61.25,52.34 63.25,52.34
  Bottom 1.27: 63.25,52.34 64.25,53.34 72.38,53.34 73.88,54.84 v74.32,54.84
  pour Route2 (isolate 0.406, rank 4): 21.75,69.09 22.38,68.47 37.25,68.47 38.5,69.72 46.63,69.72 47.75,70.84 72.88,70.84 74.13,69.59 124.19,69.59 124.94,68.84 124.94,14.78 124.57,14.41 107.25,14.41 105.38,16.28 105.38,27.16 100.19,32.34 87.07,32.34 85.88,31.16 85.88,27.84 83.63,25.59 47.25,25.59 44.19,22.53 26.57,22.53 20,29.09 20,47.66 15.63,52.03 15.63,68.66 16.07,69.09
+5V  (via drill 0.3)
  Top 0.254: 32.5,74.41 IC4.20 | v36.5,69.34 IC4.13 | IC4.4 28.44,71.34 28.19,71.59 28.19,71.97 27.88,72.28 25.82,72.28 24.23,73.87 R11.2 | v100.57,24.09 100.57,21.91 | v27.88,69.34 IC4.8 v27.88,69.34
  Top 0.406: 32.5,75.03 32.5,74.41 | IC6.17 99.48,20.82 100.57,21.91 | L4.1 103.63,21.34 103.09,21.88 C50.+ | v99.25,90.84 100.5,92.09 C45.+
  Top 0.61: IC5.4 v96.38,85.66 | IC5.25 v96.38,78.34 | v99.25,90.84 L3.2 | 100.57,21.91 C50.+
  Top 1.016: C26.+ 32.5,76.57 32.5,75.03
  Top 1.27: 32.43,76.66 C27.+ 27.78,76.66 27.32,76.66 24.53,73.87 R11.2 | R12.2 35.55,74.84 34.32,74.84 32.5,76.66 32.43,76.66 | 32.43,76.66 C26.+
  Route2 0.254: v27.88,69.34 27.69,69.34 25.88,71.16 25.88,72.22 24.23,73.87 R11.2 | 66.44,76.53 66.42,76.53 v64.13,76.53 | v102.32,89.41 99.57,89.41 99.25,89.72
  Route2 0.406: v27.88,69.34 28.13,69.09 36.25,69.09 v36.5,69.34
  Route2 0.61: v96.38,78.34 v96.38,85.66 96.38,86.84 | v99.25,90.84 99.25,89.72 96.38,86.84 | 96.38,86.84 96.13,87.09 82,87.09 78.69,83.78 78.69,81.53 73.63,76.47 66.44,76.47 66.44,76.5 | v36.5,69.34 37.57,70.41 46,70.41 47.19,71.59 v57,71.59 61.07,71.59 64.13,74.66 v64.13,76.53
  Route2 1.27: SV1.8 28.69,96.23 28.69,93.72 | SV1.10 31.25,96.2 31.25,93.72 31.23,93.72 SV1.9 31.2,93.72 28.69,93.72 | 19.94,81.98 19.94,85.22 22.75,87.97 23.69,87.97 28.69,92.97 28.69,93.72 | 28.69,93.72 | 28.69,93.72 SV1.7 | R11.2 24,73.85 24,73.84 21.97,73.84 | v100.57,24.09 99.94,24.72 96.13,24.72 94,22.59 83.75,22.59 81.07,19.91 25.44,19.91 17.32,28.03 17.32,44.03 3.19,58.22 3.19,73.59 4.82,75.22 9,75.22 12.69,78.91 16.88,78.91 16.88,78.92
  Bottom 0.254: v36.5,69.34 C24.1 | C25.1 27.24,69.34 v27.88,69.34 | v100.57,24.09 C53.1 | v57,71.59 R69.2 | v102.32,89.41 C44.2
  Bottom 1.016: J2.4 16.89,78.96 16.88,78.97 16.84,78.93 12.78,78.93
  Bottom 1.27: R10.2 10.94,71.72 10.94,77.09 12.78,78.93
  pour Route2 (isolate 0.406, rank 6): 0.13,99.84 129.63,99.84 129.88,99.59 129.88,0.16 44.63,0.16 44.63,2.59 39.5,2.59 39.5,0.16 37.32,0.16 37.32,2.59 34.63,2.59 34.63,0.16 0.38,0.16 0.13,0.41
/RD
  Top 0.254: U1.P94 68,43.47 66.19,41.66 65.5,41.66 IC1.34
/WR
  Top 0.254: U1.P96 67.75,42.47 66.19,40.91 65.57,40.91 65.53,40.87 IC1.33
A8
  Top 0.254: U1.P93 67.69,43.97 66.19,42.47 65.5,42.47 65.48,42.44 IC1.35
A9
  Top 0.254: U1.P90 68.38,45.47 66.19,43.28 65.5,43.28 IC1.36 | IC1.36
A10
  Top 0.254: U1.P89 68.07,45.97 66.13,44.03 65.5,44.03 65.49,44.02 IC1.37
A11
  Top 0.254: U1.P83 70.25,48.97 66.13,44.84 65.5,44.84 65.47,44.81 IC1.38
A12
  Top 0.254: U1.P82 70,49.47 66.13,45.59 65.5,45.59 IC1.39
A13
  Top 0.254: U1.P76 71,52.47 70.75,52.22 70.75,51.03 66.13,46.41 65.5,46.41 65.48,46.38 IC1.40
A14
  Top 0.254: U1.P75 70.75,52.97 70.25,52.47 70.25,51.28 66.13,47.16 65.44,47.16 IC1.41
A15
  Top 0.254: U1.P74 70.57,53.47 69.75,52.66 69.75,51.59 66.13,47.97 IC1.42
AD0
  Top 0.254: U1.P55 71.5,62.97 67.44,58.91 64.07,58.91 62.07,56.91 62.07,54.58 IC1.51
AD1
  Top 0.254: U1.P60 70.19,60.47 66.5,56.78 64.25,56.78 62.82,55.34 62.82,54.59 62.81,54.59 IC1.50
AD2
  Top 0.254: U1.P61 70.44,59.97 66.57,56.09 64.5,56.09 63.63,55.22 63.63,54.53 IC1.49
AD3
  Top 0.254: U1.P62 70.69,59.47 66.69,55.47 66.69,53.28 66.07,52.66 65.44,52.66 IC1.48
AD4
  Top 0.254: U1.P63 70.94,58.97 67.19,55.22 67.19,53.03 66.07,51.91 65.5,51.91 65.49,51.89 IC1.47
AD5
  Top 0.254: U1.P64 71.19,58.47 67.75,55.03 67.75,52.72 66.13,51.09 65.5,51.09 65.49,51.11 IC1.46
AD6
  Top 0.254: U1.P65 71.44,57.97 68.25,54.78 68.25,52.41 66.19,50.34 65.44,50.34 65.45,50.33 IC1.45
AD7
  Top 0.254: U1.P68 70.63,56.47 68.75,54.59 68.75,52.16 66.13,49.53 65.5,49.53 IC1.44
AGND  (via drill 0.3)
  Top 0.406: IC6.12 96.92,17.57 v96.88,17.53 | IC6.9 90.17,17.56 90.19,17.53 v91.57,17.53
  Route15 0.406: v91.57,17.53 92.88,17.53 93.38,16.97 v94.25,16.97 95.63,16.97 96.19,17.53 v96.88,17.53
  Bottom 0.406: v94.25,16.97 R38.2
AGNDAD  (via drill 0.3)
  Top 0.254: 90.07,77 IC5.20 | IC5.16 84.96,77.58 84.94,77.59 | 83.75,71.97 v83.75,72.47
  Top 0.406: 90.07,77 90.07,77.78 90.44,78.16 v90.44,78.47 | 84.94,77.59 84.94,78.09 v84.57,78.47 | C41.- 83.75,71.97 | IC5.13 84.94,87.15 84.94,87.59 85.44,88.09 | C42.- 87.25,90.09 v86.19,90.09
  Top 0.61: IC5.13 84.94,87.11 v84.94,85.91 | 87.07,93.71 87.07,93.72 | SV2.1 87.07,93.71 | C42.- 87.07,90.22 87.07,93.71 | v83.69,95.97 C34.-
  Route15 0.254: v72.44,86.16 72.44,86.78 72.7,87.03 78.38,87.03 v79.25,86.16
  Route15 0.406: SV2.2 88.6,97.78 92.13,97.78 | 92.13,97.78 95.69,97.78 97.19,96.28 97.19,96.22 | 92.13,97.78 92.13,96.28 | 92.13,96.28 SV2.6 | 92.13,96.28 SV2.5 | 97.19,96.22 SV2.10 | SV2.9 97.19,93.71 97.19,96.22 | v79.25,86.16 81.19,84.22 v83.88,84.22
  Route15 0.61: v83.75,72.47 84.82,73.53 84.82,76.34 84.57,76.59 v84.57,78.47 85.5,79.41 | 85.5,79.41 89.5,79.41 | 89.5,79.41 v90.44,78.47 | 89.5,79.41 89.5,81.66 v89.69,81.84 89.69,82.91 v91,84.22 | 85.5,79.41 85.5,82.59 v83.88,84.22 83.88,84.84 v84.94,85.91 | 87.07,93.71 87.07,93.72 85.94,93.72 v83.69,95.97 81.75,97.91 X2.1 | SV2.2 87.07,96.22 87.07,93.71 | 87.07,93.71 SV2.1 | v83.69,91.59 85.19,90.09 v86.19,90.09
  Bottom 0.254: C35.2 90.38,79.22 90.38,78.53 v90.44,78.47 | C36.2 84.5,79.22 84.5,78.53 v84.57,78.47 | v83.75,72.47 C40.2 | v72.44,86.16 C33.1
  Bottom 0.406: v79.25,86.16 C32.1 | v86.19,90.09 C43.2
  Bottom 0.61: v89.69,81.84 R25.1 | v91,84.22 C37.2 | v83.88,84.22 C38.2 | v83.69,91.59 C39.2
  pour Route15 (isolate 0.254): 91.25,77.97 91.25,84.97 90.57,84.97 90.57,88.22 97.75,88.22 97.75,91.91 99.32,93.47 99.32,99.72 65.57,99.72 65.57,82.78 71.75,82.78 71.75,74.78 81.57,74.78 81.57,69.22 85.44,69.22 85.44,75.78 90.57,75.78 90.57,77.97
AGNDDA  (via drill 0.3)
  Top 0.406: v100.63,13.97 C52.- | v95.13,13.97 93.69,13.97 92.44,12.72 C57.- v91.13,12.72 | v87.38,11.41 C54.-
  Route15 0.254: 87,7.22 87,11.03 v87.38,11.41 87.38,14.6 v85.32,16.66
  Route15 0.406: v95.13,13.97 v100.63,13.97 | v87.38,11.41 89.82,11.41 v91.13,12.72
  Route15 0.61: X3.1 74.7,1.66 85.57,1.66 87.07,3.16 | 87.07,4.75 87.07,4.78 | 87.07,3.16 87.07,4.75 | SV3.2 87.06,7.28 87.07,7.28 87.07,4.75 | 87.07,4.75 SV3.1 | SV3.5 92.13,4.72 92.13,3.16 | 87.07,3.16 92.13,3.16 | 92.13,3.16 97.19,3.16 97.19,4.72 SV3.9 97.19,7.26 SV3.10
  Bottom 0.254: C51.2 86.91,16.66 v85.32,16.66
  Bottom 0.406: v100.63,13.97 C49.2 | v95.13,13.97 C58.2
  pour Route15 (isolate 0.254): 67.44,18.78 86.25,18.78 86.94,18.09 87.38,18.09 87.88,18.09 88.63,18.84 99.5,18.84 100.32,18.03 101.38,18.03 101.82,18.47 101.82,19.34 102.75,20.28 103.75,20.28 104.69,19.34 104.69,15.35 103.57,14.22 103.57,0.47 67.32,0.47 67.07,0.72 67.07,18.47
ALE
  Top 0.254: U1.P69 70.82,55.97 69.25,54.41 69.25,51.84 66.13,48.72 65.5,48.72 65.48,48.74 IC1.43
AVDDAD  (via drill 0.3)
  Top 0.254: 90,87.16 90.01,87.16 IC5.9
  Top 0.406: 90.01,87.16 v90.01,85.98 v90,85.97
  Top 0.61: L3.1 96.09,90.03 C42.+
  Bottom 0.254: 89.63,90.07 C43.1 89.57,90.09 90,89.66 v90,85.97
  Bottom 0.406: C42.+ 92.19,90.09 89.66,90.09 89.63,90.07
  other vias: 92.25,90.03
AVDDDA  (via drill 0.3)
  Top 0.254: 100.63,17.78 C52.+ | 98,18.84 99.57,18.84 100.63,17.78 | 100.63,17.78 v100.63,19.03
  Top 0.406: 98,18.84 IC6.14 97.94,18.84 95.69,18.84 95.63,18.78 92.88,18.78 92.79,18.87 IC6.7 88.53,18.87 87.38,17.72 | C54.+ 87.38,17.72 | 87.38,17.72 v87.38,19.03
  Top 0.61: v103.63,17.91 L4.2
  Bottom 0.254: 100.63,17.84 C49.1 v100.63,19.03
  Bottom 0.406: 103.6,17.88 v103.63,17.91 | v87.38,19.03 C51.1
  Bottom 0.61: C49.1 103.6,17.88
CFG_DONE  (via drill 0.3)
  Top 0.254: IC3.13 104,29.78 99.82,29.78 95.07,25.03 v93.07,25.03 | R13.2 83.82,29.09 | R13.2 | R13.2 v84.63,29.09
  Bottom 0.254: v93.07,25.03 88.63,25.03 84.63,29.03 v84.63,29.09
CLK8MHZ  (3 unrouted)
  Bottom 0.61: 55.83,32.53 55.82,32.53 | R68.1 55.83,32.53 | R67.2 58.62,32.53 57.25,32.53 | 55.83,32.53 57.25,32.53 | 57.25,32.53 Q1.1
DONE  (via drill 0.3)
  Top 0.254: v97.82,41.28 98.32,41.28 99.13,40.47 99.19,40.47 100.75,38.91 100.75,36.91 102.69,34.97 102.69,34.22 IC3.10 102.7,34.27 102.69,34.28 | v95.5,41.53 94.7,41.53 94.69,41.54 94.32,41.91 91.63,41.91 88.88,39.16 75.5,39.16 74.82,38.47 U1.P104
  Bottom 0.254: v97.82,41.28 97.04,40.51 R2.1 96.53,40.51 v95.5,41.53
FPGACLK  (1 unrouted)
FRST
  Top 0.254: IC1.29 61.25,39.03 61.25,39.91 61.82,40.47 64,40.47 64.5,39.97 68.69,39.97 69.19,40.47 U1.P100 72.63,40.47
GND  (via drill 0.3, 0.6)  (2 unrouted)
  Top 0.254: IC4.15 32.5,70.34 32.13,69.97 IC4.TGND2 | IC4.TGND2 31.69,69.97 | IC4.TGND2 | IC4.TGND2 31.37,70.34 IC4.6 | 31.69,71.22 IC4.TGND1 31.7,71.23 31.69,71.22 | IC4.TGND2 31.69,70.02 31.69,71.22 | IC4.18 32.32,71.84 31.69,71.22 | D2.A 41.36,76.02 41.38,76.03 v41.38,77.41 | IC1.63 52.58,53.6 v52.57,53.59 | IC2.14 31.76,29.23 v31,28.47 | R20.1 29.54,47.16 v30.13,47.16 | IC1.22 55.75,38.99 v55.75,37.47 | IC1.53 v60.44,53.09 | v19.25,72.91 v18.38,72.91 v17.5,72.91 | v41.38,77.41 v40.5,77.41 | v41.38,77.41 v42.25,77.41 | v32.44,80.84 32.44,83.38 C26.- 32.44,83.42 v32.44,82.78 | C28.- 22.75,83.44 v22.75,84.91 | C27.- 27.75,83.44 v27.75,84.91 27.82,84.84 v28.75,84.84 | v6.25,71.72 LED4.C | v6.25,68.97 LED1.C | v6.25,66.22 LED3.C | LED2.C v6.25,63.47 | C13.- 19.88,60.38 v19.88,61.84 | v74.38,42.97 U1.P95 | v77.38,54.84 77.38,54.97 | v71.13,47.97 71.13,48.47 72.5,48.47 | v71.13,47.97 U1.P85 | v71.13,47.97 71.13,47.47 U1.P86 | U1.P37 82.19,66.13 v82.19,67.59 | U1.P10 95.69,66.11 95.69,65.22 96,64.91 v96,64.16 | U1.P17 92.19,66.11 v92.19,63.91 | v100.5,63.97 U1.P208 | U1.P188 103.88,53.97 v104.13,53.72 | v104.13,51.66 103.44,50.97 U1.P182 | U1.P156 100.19,36.33 100.19,38.53 99.88,38.84 v99.32,38.84 | U1.P141 92.69,36.33 92.69,37.53 v92.07,38.16 | IC3.11 v102.69,27.72 | v100.57,28.22 C50.- | U1.P121 82.68,34.98 v82.69,34.97 | U1.P131 87.68,36.33 87.69,36.34 v87.69,34.97 | U1.P105 74.68,37.39 75.38,38.09 v75.82,38.09 | U1.P70 71.5,55.47 v71.13,55.09 | v103.69,46.78 103.38,46.47 U1.P173 | 74.69,66.11 U1.P52 74.69,66.13 v74.69,67.59 | v100.57,58.97 U1.P198 | v71.13,63.97 U1.P53 | v87.25,63.91 87.19,63.97 87.19,66.11 U1.P27 | U1.P79 73.63,50.97 73.88,50.72 73.88,48.66 73.69,48.47 72.5,48.47
  Top 0.254: 72.5,48.47 U1.P84 | R4.1 33.22,65.41 v32.44,65.41 | 34.88,1.09 34.88,0.59 37.07,0.59 37.07,1.03 | 37.07,1.03 37.07,1.09 35,1.09 35,0.78 36.88,0.78 36.88,0.91 35.07,0.91 | v36.19,4.66 36.25,4.66 36.25,4.59 37.07,4.59 37.07,1.03
  Top 0.406: R4.1 32.91,65.44 31.75,66.59 v31.75,67.03 | v99.63,19.91 99.37,20.17 IC6.16 97.95,20.17 97.94,20.16 v94.25,20.16 | C45.- 102.32,94.28 v102.32,92.41
  Top 0.61: D1.A 18.36,72.88 v18.38,72.91 | v92.69,81.84 92.75,81.91 95.07,81.91 | IC5.24 | 95.07,81.91 95.13,81.84 IC5.24 | IC5.5 95.13,87.16 | IC5.5 | 95.07,81.91 95.13,81.97 IC5.5 | v95.13,75.22 IC5.24
  Top 1.27: R20.1 29.48,48.01 33.19,51.72 33.19,53.53 33.25,53.59 C12.- | 27.82,83.41 C27.-
  Route15 0.254: v24.88,69.34 v24.88,71.59 24.88,72.09 26.38,73.59 28.07,73.59 28.57,74.09 29.88,74.09 | IC4.TGND1 31.7,71.23 31.69,71.22 31.63,71.28 31.63,72.34 29.88,74.09 | v34.38,76.84 34.38,76.16 33.38,75.16 30.94,75.16 29.88,74.09 | v41.19,73.72 41.19,77.22 v41.38,77.41 | v52.57,53.59 52.94,53.59 53.63,52.91 53.63,50.53 52.57,49.41 v52.5,49.34 52.5,48.59 57,48.59 | 57,48.59 v57,49.34 60.44,49.34 | v29.19,28.47 v31,28.47 31.69,27.78 31.69,24.72 31.19,24.22 v30.88,24.22 30.88,22.72 29.88,21.72 22.32,21.72 18,17.41 12.54,17.41 | v58.75,26.97 61.07,29.28 v61.07,32.53 61.07,34.4 QG2.4 60.32,34.66 58.5,36.47 56.75,36.47 v55.75,37.47 55.75,42.91 56.5,43.66 v56.5,44.22 | 57,44.72 57,48.59 | v56.5,44.22 57,44.72 | 57,44.72 57,44.66 58.75,44.66 | 58.75,44.66 v58.75,44.28 | v61,44.28 61,44.66 58.75,44.66 | 60.44,49.34 v61.25,49.34 62.63,47.97 v71.13,47.97 | 58.8,61.28 58.82,61.28 58.82,74.28 v61.07,76.53 | 60.44,59.64 v60.44,53.09 60.44,49.34 | v33.38,80.84 v32.44,80.84 v31.44,80.84 | 76.07,42.97 v74.38,42.97 | 76.07,42.97 77.38,44.28 v77.38,44.47 v77.38,46.59 | v77.38,46.59 77.38,46.66 | v77.38,46.59 77.38,47.97 v71.13,47.97 | 78.57,50.59 79.32,51.34 79.32,53.72 78.19,54.84 v77.38,54.84 v77.38,56.97 75,59.34 v75,59.84 76.44,61.28 | 76.44,61.28 v77.69,61.28 v81.69,61.28 81.69,61.47 82.88,62.66 82.88,63.84 | 82.88,63.84 82.88,66.91 v82.19,67.59 82.07,67.59 v78.69,70.97 | 94.19,62.34 v96,64.16 | 94.19,62.34 v94.19,60.66 v90.19,60.66 90.19,60.97 v87.25,63.91 87.19,63.84 82.88,63.84 | v92.19,63.91 93.75,62.34 94.19,62.34 | v100.5,63.97 99.88,63.34 99.5,63.34 | 99.5,63.34 97.94,63.34 96.69,64.59 96.57,64.59
  Route15 0.254: JP1.13 124.81,3.86 124.82,3.84 124.88,3.91 | 104.13,52.66 v104.13,51.66 104.13,47.22 v103.69,46.78 103.38,46.47 98.38,46.47 v97.07,47.78 | 104.13,52.66 v104.13,53.72 | 102.19,28.22 v102.69,27.72 102.69,22.78 101.94,22.03 | 102.19,28.22 v100.57,28.22 | 102.19,28.22 102.19,29.66 103.94,31.41 v104.07,31.41 103.82,31.41 102.5,32.72 102.5,34.66 101.25,35.91 101.25,36.91 v99.32,38.84 99.32,39.53 99,39.84 95,39.84 v93.69,41.16 93.69,39.78 v92.07,38.16 92.07,36.16 90.88,34.97 v87.69,34.97 v82.69,34.97 | SW1.11 122.06,30.96 120.75,29.66 120.75,24.91 117.82,22.03 101.94,22.03 | 101.94,22.03 100,20.22 99.69,19.97 v99.63,19.91 | v75.82,38.09 76.07,38.34 76.07,41.16 | 76.07,42.97 76.07,41.16 | 76.07,41.16 v79.19,41.16 v81.32,41.16 v84.69,41.16 | v71.13,47.97 v71.13,55.09 | 76.44,61.28 74.32,63.41 | v100.57,58.97 99.5,60.03 99.5,60.53 | 99.5,63.34 99.5,60.53 | 99.5,60.53 v97.19,60.53 v97.19,57.41 97.19,52.91 97.45,52.66 104.13,52.66 | 74.32,63.41 73.75,63.97 v71.13,63.97 | 74.32,63.41 74.69,63.78 v74.69,67.59 | v52,44.22 52.88,45.09 55.44,45.09 56.32,44.22 v56.5,44.22 | v31.75,67.03 31.75,69.97 | 78.47,50.25 | v77.38,50.59 78.13,50.59 78.47,50.25 | v32.44,65.41 32.44,47.41 32.19,47.16 v30.13,47.16 | v21.82,84.84 22.69,84.84 v22.75,84.91 23.69,84.91 v23.75,84.84 | v26.82,84.84 27.69,84.84 v27.75,84.91 | 32.44,84.91 33.32,84.91 v33.38,82.78 | 31.44,84.91 v31.38,82.78 v32.44,82.78
  Route15 0.406: v41.19,73.72 41.19,72.72 40.07,71.59 v39.57,71.59 39.57,73.41 37.44,75.53 35,75.53 34.38,76.16 | IC4.TGND2 31.75,69.98 31.75,69.97 32.13,70.34
  Route15 0.61: v18.38,72.91 v19.25,72.91 20.5,72.91 21.82,71.59 v24.88,71.59 | v95.13,75.22 94.38,74.47 94.38,71.28 95.69,69.97 95.69,66.84 96.57,65.97 96.57,64.59 96.13,64.16 v96,64.16 | v105.5,91.72 106,91.22 106,63.97 v100.5,63.97 | 114.75,3.84 114.74,3.86 JP1.3 | JP1.1 112.74,3.86 112.75,3.84 112.77,3.86 JP1.3 | JP1.5 116.74,3.86 116.75,3.84 | JP1.5 JP1.3 | JP1.5 118.68,3.86 118.69,3.84 118.7,3.86 JP1.7 JP1.9 | JP1.9 120.74,3.86 120.75,3.84 | JP1.9 JP1.11 122.74,3.86 122.75,3.84 122.77,3.86 JP1.13 | 124.88,3.91 125.44,3.91 126,4.47 126,7.09 123.18,9.92 JP2.8 123.18,25.71 123.32,25.84 123.31,25.86 SW1.9 123.31,28.33 123.32,28.34 123.31,28.36 SW1.10 SW1.11 | SW1.11 123.32,30.97 | SW1.11 123.31,33.42 123.25,33.47 123.28,33.49 SW1.12 SW1.13 | SW1.13 | SW1.13 SW1.14 | SW1.14 123.31,38.58 123.32,38.59 | SW1.14 123.31,41.08 123.32,41.09 SW1.15 SW1.16 | SW1.16 | SW1.16 | v82.69,34.97 82.69,41.16 v81.32,41.16 | 77.38,47.97 77.38,49.16 78.47,50.25 78.57,50.34 78.57,50.59
  Route15 1.016: 30.32,29.09 30.32,45.03
  Route15 1.27: 23.61,93.72 23.63,93.72 | 23.61,93.72 SV1.3 23.63,93.67 23.63,93.66 26.09,93.66 SV1.5 SV1.6 | 21.07,93.72 SV1.1 21.06,93.67 21.07,93.66 16.89,89.48 | 21.07,93.72 23.61,93.72 | SV1.2 21.07,93.72 | SV1.4 23.62,96.22 23.63,96.22 23.63,93.74 23.61,93.72 | SV1.6 26.13,96.28 | SV1.6 | v30.13,47.16 30.13,45.22 30.32,45.03 | 30.32,29.09 30.94,28.47 v31,28.47 | v34.38,76.84 34.38,79.97 v32.44,80.84 v31.44,80.84 v31.38,82.78 | v27.75,84.91 v22.75,84.91 | v27.75,84.91 31.44,84.91 32.44,84.91 | 16.94,83.97 17.88,84.91 v22.75,84.91 | v22.75,81.91 v21.82,81.91 | v22.75,81.91 v23.75,81.91 | v22.75,84.91 v22.75,81.91 | v27.75,84.91 v27.75,81.91 | v27.75,81.91 v26.82,81.91 | v27.75,81.91 v28.75,81.91 | 16.88,84 16.88,83.97 13.63,83.97 11.5,81.84 11.5,79.66 9.13,77.28 6.94,77.28 6.25,76.59 v6.25,71.72 v6.25,68.97 v6.25,66.22 v6.25,63.47 6.25,62.59 7,61.84 v18.88,61.84 | v18.88,61.84 v19.88,61.84 | v19.88,61.84 v20.82,61.84 | v18.88,61.84 v19.88,61.84 | 58.82,74.28 58.75,74.28 55.63,77.41 v42.25,77.41 v41.38,77.41 v40.5,77.41
  Route15 2.54: 16.94,83.97 J2.3
  Bottom 0.254: C9.1 | C25.2 25.5,69.34 v24.88,69.34 | C10.1 25.5,71.61 25.5,71.59 v24.88,71.59 | v34.38,76.84 R6.1 | C11.1 41.16,73.76 v41.19,73.72 | v52.5,49.34 R22.1 | v57,49.34 R66.1 | C14.2 31.63,29.09 v31,28.47 | C6.1 29.14,29.1 29.13,29.09 29.19,29.03 v29.19,28.47 | C7.1 30.85,24.18 v30.88,24.22 | 60.31,32.47 60.19,32.47 | 60.31,32.47 R67.1 | v61.07,32.53 61,32.47 60.31,32.47 | C63.2 v58.75,26.97 | 56.5,43.47 C1.1 v56.5,44.22 | 58.75,43.59 58.75,44.22 | 58.75,43.59 C8.1 | v58.75,44.28 58.75,43.59 | v61,44.28 C22.2 | v61.25,49.34 C29.2 | 76.69,44.47 C67.2 v77.38,44.47 | C19.2 76.74,46.59 v77.38,46.59 | v77.38,50.59 76.68,50.59 | C20.2 76.67,54.84 v77.38,54.84 | v77.38,56.97 C16.2 | C18.2 75,59.1 v75,59.84 | v77.69,61.28 C48.2 | v81.69,61.28 C46.2 | v78.69,70.97 C64.2 | 94.19,61.34 C3.2 v94.19,60.66 | v90.19,60.66 C47.2 | 99.32,39.53 C65.2 v99.32,38.84 | v93.69,41.16 C61.2 | C21.2 104.72,31.53 v104.07,31.41 | v79.19,41.16 C59.2 | v84.69,41.16 C60.2 | v81.32,41.16 C17.2 | C15.2 98.19,45.66 98.19,47.78 | 98.19,47.78 C70.2 | v97.07,47.78 98.19,47.78 | C69.2 98.16,60.53 v97.19,60.53 | v97.19,57.41 C66.2 98.19,57.41 C68.2 | v52,44.22 C2.1
  Bottom 0.406: C24.2 38.85,69.44 39.57,70.16 v39.57,71.59 v39.56,71.6 C9.1 | C44.1 v102.32,92.41 | v99.63,19.91 100.32,19.91 100.57,20.16 C53.2 | v94.25,20.16 R38.1
  Bottom 0.61: 60.32,32.53 R67.1 | v92.69,81.84 R25.2 | C44.1 102.35,91.72 v105.5,91.72 | v77.38,50.59 77.32,50.66
  other vias: 80.44,50.72 80.44,54.03 83.44,58.03 86.88,58.16 90.88,58.03 93.19,55.28 94.32,50.72 93.19,46.97 87.32,46.84 83.44,47.72 89,53.72 83.32,51.59 86.19,55.03 91.44,49.97 86,49.41 88.75,42.72 83,42.84 38.94,95.34 50.94,95.66 41.5,93.28 40.19,86.47 46.5,84.97 36.94,89.78 65.07,86.59 62,86.91 62.82,82.66 55.94,85.03 46.5,80.22 41.32,81.03 31.19,89.09 25.82,87.78 5.44,58.28 10,54.28 5.25,49.59 11.32,46.28 15.32,51.28 5.13,42.97 15.32,40.97 23,38.66 20.19,32.41 19.44,22.09 23.63,17.34 18,14.91 4.25,3.59 12.69,3.34 19.19,5.91 25.57,15.91 25.38,6.72 22.38,6.41 33.07,5.59 32.5,7.84 34,16.66 28.69,18.16 26.07,21.59 41.5,26.66 29.07,37.41 26.07,35.09 31.32,42.41 38.44,32.09 46.94,26.66 42.07,21.09 41.63,15.1 37.82,12.6 37.94,5.59 45.5,5.59 47.69,20.97 59.07,18.97 49.25,7.84 56.94,4.34 56.44,8.72 65,16.09 54.88,16.84 74.57,22.09 81.44,24.97 79.38,21.53 74.32,26.53 41.38,90.34 106.63,97.34 100.94,98.22 103.75,86.91 103.94,81.91 109.38,82.34 107.82,83.41 107.13,94.28 112.38,93.16 85,21.09 75.13,18.72 69.63,21.53 67.69,17.91 65.44,12.47 65.57,8.66 65.44,5.22 64.57,2.78 59.94,1.91 53.69,2.16 46.25,2.16 41.5,5.16 31.07,1.91 26.19,1.91 21,2.34 16.44,2.34 10.13,1.78 5.44,1.78 1.25,5.47 1.25,14.66 1.57,22.22 1.57,28.66 1.82,36.09 1.57,42.84 1.69,46.97 1.69,49.84 1.69,55.03 1.69,60.16 1.82,63.91 1.57,67.16 1.44,70.34 1.44,73.34 1.57,77.03 1.57,80.34 1.57,85.22 1.57,89.34 1.69,92.78 1.82,97.53 5.44,98.53 8.88,98.34 17,98.34 22.32,98.53 26.75,98.66 31.07,98.78 35.19,98.78 41.5,98.66 46.5,98.53 37.38,98.53 13.07,58.53 44.5,95.53 51.25,98.66 56.38,98.53 60.57,98.53 62.57,96.34 63.88,93.59 63.5,90.66 117.38,93.28 122.25,93.28 127.25,93.03 127.82,89.84 127.82,85.72 127.82,83.16 128.13,80.03 128.13,76.47 128.25,72.78 128.25,69.16 128.25,65.72 128.25,62.28 128.25,57.72 128.13,53.84 128.13,49.84 128.25,45.53 128.13,41.09 128.25,38.53 128.13,35.41 128.13,31.66 128.13,28.41 128.38,24.78 128.38,21.34 128.38,18.34 128.25,14.66 128.38,10.47 128.38,7.03 128.25,3.22 126.57,1.47 123.38,1.47 120.38,1.59 116.94,1.59 113.25,1.59 110.63,1.59 107.63,1.78 105.19,1.78 105.07,4.34 105.07,6.47 105.07,8.47 106.5,14.66 106.63,16.47 106.5,18.78 126.25,14.78 123.38,14.91 118.94,15.1 113.5,16.03 111.44,18.09 117.69,19.09 121.82,19.34 126,17.66 115.82,22.22 112.25,25.66 113.07,30.97 113.44,40.59 111.69,42.41 108.94,44.78 112.25,47.16 117.5,47.84 123.82,47.84 123.94,81.47 121.94,83.03 113.38,81.97 117.69,81.47 112.38,78.59 111.25,74.59 116.69,72.16 122.69,70.59 124.94,75.34 119.82,77.34 107.63,74.78 106.94,79.78 104.19,76.03 104.94,71.91 104.07,68.34 106.82,68.72 75.88,71.03 72.25,69.59 70.13,70.91 66.44,73.16 60.75,73.22 47.75,77.66 47.25,59.59 48.44,60.34 48.94,57.16 50.25,59.84 48.19,54.59 46.44,74.34 54.13,74.34 54.13,79.03 56.38,81.22 35.07,22.97 36.94,27.91 37.07,35.22 41.19,39.34 55.32,22.72 62.5,21.97 6.19,30.53 6.13,15.03 15.63,31.47 9.57,42.34 6.32,7.66 46.44,6.28 11,86.72 12.13,92.03 4.5,86.34 37.32,82.16 35.32,93.66 44.75,87.66 66.94,82.09 100.63,6.03
  pour Route15 (isolate 0.406, rank 6): 0.13,99.91 129.81,99.91 130.07,99.65 130.07,0.16 44.63,0.16 44.63,2.59 41.94,2.59 41.94,0.16 39.75,0.16 39.75,2.59 34.63,2.59 34.63,0.16 0.51,0.16 0.25,0.41 0.25,99.59
  pour Top (isolate 1.016, rank 4): 0.13,99.78 129.81,99.78 130.07,99.53 130.07,93.22 128.63,91.78 109,91.78 108.44,91.22 108.44,84.47 109,83.91 128.75,83.91 130.07,82.59 130.07,0.16 44.63,0.16 44.63,2.59 37.07,2.59 37.07,0.16 0.51,0.16 0.25,0.41 0.25,99.66
  pour Bottom (isolate 0.406, rank 4): 0.25,99.66 129.69,99.66 129.94,99.4 129.94,0.16 42.19,0.16 42.19,2.59 34.63,2.59 34.63,0.16 0.51,0.16 0.25,0.41
  pour Top (isolate 0.254, no thermals): 30.5,75.34 28.63,75.34 28.38,75.09 28.38,66.97 29.57,65.78 34.57,65.78 35.5,66.72 35.5,73.66 33.57,75.59 29.88,75.59
  pour Route15 (isolate 0.254, no thermals): 30.94,72.66 32.94,72.66 33.44,72.16 33.44,69.28 32.63,68.47 31.25,68.47 30.32,69.41 30.32,72.03
  pour Bottom (isolate 0.254, no thermals): 30.75,72.41 32.57,72.41 33.19,71.78 33.19,69.41 32.57,68.78 30.94,68.78 30.32,69.41 30.32,72.03
  pour Top: 124.94,92.41 126.25,91.09 126.25,84.66 125.25,83.66 125.82,83.09 128.57,83.09 128.88,83.41 128.88,92.84 128.5,93.22 125.25,93.22 124.94,92.91
N$1  (via drill 0.3)
  Top 0.254: R13.1 76.38,29.09 v66.57,38.91 | IC1.8 49.99,47.17 50,47.16 v59.5,47.16
  Bottom 0.254: v66.57,38.91 66.57,40.59 61.82,45.34 61.32,45.34 v59.5,47.16
N$2  (via drill 0.3)
  Top 0.254: R14.1 75.32,31.34 v67.75,38.91 | IC1.9 49.94,46.35 49.94,46.34 v61.57,46.34
  Bottom 0.254: v67.75,38.91 67.75,40.16 v61.57,46.34
N$3
  Top 0.406: X6.8 10,24.22 10.03,24.19 X6.7
N$4  (via drill 0.3)
  Top 0.254: U1.P158 v105.32,38.97 109.32,38.97 111,37.28 111,24.59 R17.2 | IC3.6 105.32,34.23 v105.32,33.22
  Bottom 0.254: v105.32,38.97 104.38,38.03 104.38,36.72 104.88,36.22 104.88,33.66 v105.32,33.22
N$5
  Top 0.254: R17.1 110.16,21.25 118.07,13.35 118.07,11.66 118.1,11.62 JP2.6 118.13,11.6 | 116.74,5.86 JP1.6 116.73,7.58 118.07,8.91 118.07,11.6
  Top 0.61: 118.07,11.6 JP2.6
N$6  (via drill 0.3)
  Top 0.254: U1.P207 103.32,63.47 103.82,62.97 v103.82,62.59
  Bottom 0.254: v103.82,62.59 107.13,59.28 107.13,40.91 110.5,37.53 110.5,27.78 109.38,26.59 R18.2
N$7  (via drill 0.3)
  Top 0.254: v107.13,23.59 106.44,24.28 106.44,27.66 106.63,27.84 106.63,28.84 106.62,28.84 IC3.17
  Bottom 0.254: R16.2 v107.13,23.59
N$8  (via drill 0.3)
  Top 0.254: IC4.16 35.75,70.84 v36.5,71.59
  Bottom 0.254: C9.2 37.13,71.6 37.13,71.59 v36.5,71.59
N$9  (via drill 0.3)
  Top 0.254: v105.94,29.97 106.25,30.28 106.25,33.34 105.94,33.66 105.94,34.26 | 105.94,34.26 105.94,34.28 | 105.94,34.26 IC3.5 | 105.94,34.26 105.94,35.28 104.88,36.34 v102.63,36.34 | 99.69,36.33 99.69,36.34 | 99.69,36.33 U1.P155 | v100.44,34.59 99.69,35.34 99.69,36.33
  Bottom 0.254: R19.2 104.88,26.78 105.94,27.84 v105.94,29.97 | v102.63,36.34 100.88,34.59 v100.44,34.59
N$10  (via drill 0.3)
  Top 0.254: v108.44,19.34 113,14.78 113,11.6 113.01,11.6 JP2.4 113.02,11.55 113,11.53 113.07,11.47 v113.07,7.78 | JP1.8 118.73,7.76 v118.75,7.78
  Bottom 0.254: R16.1 107.13,20.66 v108.44,19.34 | v113.07,7.78 v118.75,7.78
N$11  (via drill 0.3)
  Top 0.254: JP1.10 120.73,7.24 v119.82,8.16 | JP2.3 110.44,11.6 v110.44,8.03
  Bottom 0.254: R18.1 109.38,15.72 110.44,14.66 110.44,11.6 JP2.3 110.5,11.58 | v119.82,8.16 119.19,8.78 111.19,8.78 v110.44,8.03
N$12  (via drill 0.3)
  Top 0.254: JP1.4 114.73,9.47 v114.69,9.47
  Bottom 0.254: v114.69,9.47 105.94,9.47 105.38,10.03 JP2.1 105.4,20.7 104.88,21.22 R19.1
N$13  (via drill 0.3)
  Top 0.254: IC4.5 28.25,70.84 v27.5,71.59
  Bottom 0.254: C10.2 27.24,71.59 v27.5,71.59
N$14  (via drill 0.3)
  Top 0.254: 34.75,72.41 34.69,72.34 IC4.19
  Top 0.406: v35,73.34 35,72.66 34.75,72.41
  Bottom 0.406: C11.2 38.86,73.8 37.5,75.16 35.69,75.16 35,74.47 v35,73.34
N$15  (via drill 0.6)
  Top 0.254: D1.C 18.36,64.13 18.38,64.16
  Top 2.54: 18.38,64.16 21.94,64.16 22.25,63.84 L2.1 | L2.1 27.07,63.84 | L2.1 27.05,57.8 v27.07,57.78
  Bottom 2.54: Q3.2 27.07,56.09 v27.07,57.78
N$16
  Top 0.254: IC2.1 26.69,30.53 46.5,50.34 49.91,50.34 IC1.4
N$17
  Top 0.254: IC1.5 46.75,49.53 34.13,36.91 34.13,30.91 33.75,30.53 IC2.16
N$18
  Top 0.254: IC1.6 46.97,48.74 34.69,36.47 34.69,28.59 34,27.91 33.06,27.91 IC2.12
N$19
  Top 0.254: IC1.7 49.92,47.97 47.25,47.97 35.25,35.97 35.25,27.09 34.82,26.66 33.07,26.66 33.07,26.65 IC2.10
N$20  (via drill 0.3)
  Top 0.254: IC2.5 25.82,27.91 27.63,27.91 v27.82,27.72
  Bottom 0.254: C5.1 30.21,27.07 29.57,27.72 v27.82,27.72
N$21  (via drill 0.3)
  Top 0.254: IC2.6 27.07,27.28 v27.88,26.47
  Bottom 0.254: C5.2 28.51,26.46 28.5,26.47 v27.88,26.47
N$22  (via drill 0.3)
  Top 0.254: IC2.4 25.78,28.59 v24.38,28.59
  Bottom 0.254: v24.38,28.59 26.07,28.59 26.57,29.09 C4.2
N$23  (via drill 0.3)
  Top 0.254: IC2.2 25.77,29.91 v24.38,29.91
  Bottom 0.254: C4.1 26.7,30.78 25.25,30.78 v24.38,29.91
N$24
  Top 0.254: IC3.4 106.63,34.27 106.63,36.84 106.38,37.09 106.38,37.66 105.88,38.16 104.63,38.16 104.32,38.47 U1.P157
N$25  (via drill 0.3)
  Top 0.254: IC2.3 25.8,29.22 27.5,29.22 29.19,30.91 v29.19,31.47
  Bottom 0.254: C6.2 29.18,30.78 29.19,30.78 v29.19,31.47
N$26  (via drill 0.3)
  Top 0.254: IC2.7 26.78,26.63 27.13,26.28 27.13,24.91 v27.88,24.16
  Bottom 0.254: C7.2 28.53,24.18 28.5,24.16 v27.88,24.16
N$27  (via drill 0.3)
  Top 0.254: 73.57,46.97 74.38,47.78 74.38,48.53 v74.63,48.78 | v78.32,48.78 78.32,48.28 81.88,44.72 95.32,44.72 95.88,44.16 v96.5,44.16 | 108.57,34.24 108.57,34.22 | 108.57,34.24 IC3.1 | v109.19,35.47 108.57,34.84 108.57,34.24
  Bottom 0.254: v74.63,48.78 v78.32,48.78 | v96.5,44.16 103.94,44.16 106.13,41.97 106.13,40.41 109.19,37.34 v109.19,35.47
N$28  (via drill 0.3)